# Altium project COMMS_ECU_revA.PrjPcb (part 2 of 3)

## Sheet SJA1105Q_PINOUT.SchDoc
size D; SheetNumber: 4; SheetTotal: 12
Used 2 times, as channels SJA1150Q_PINOUT_0, SJA1150Q_PINOUT_1. Parts and nets are listed once, with the designators drawn on the sheet.
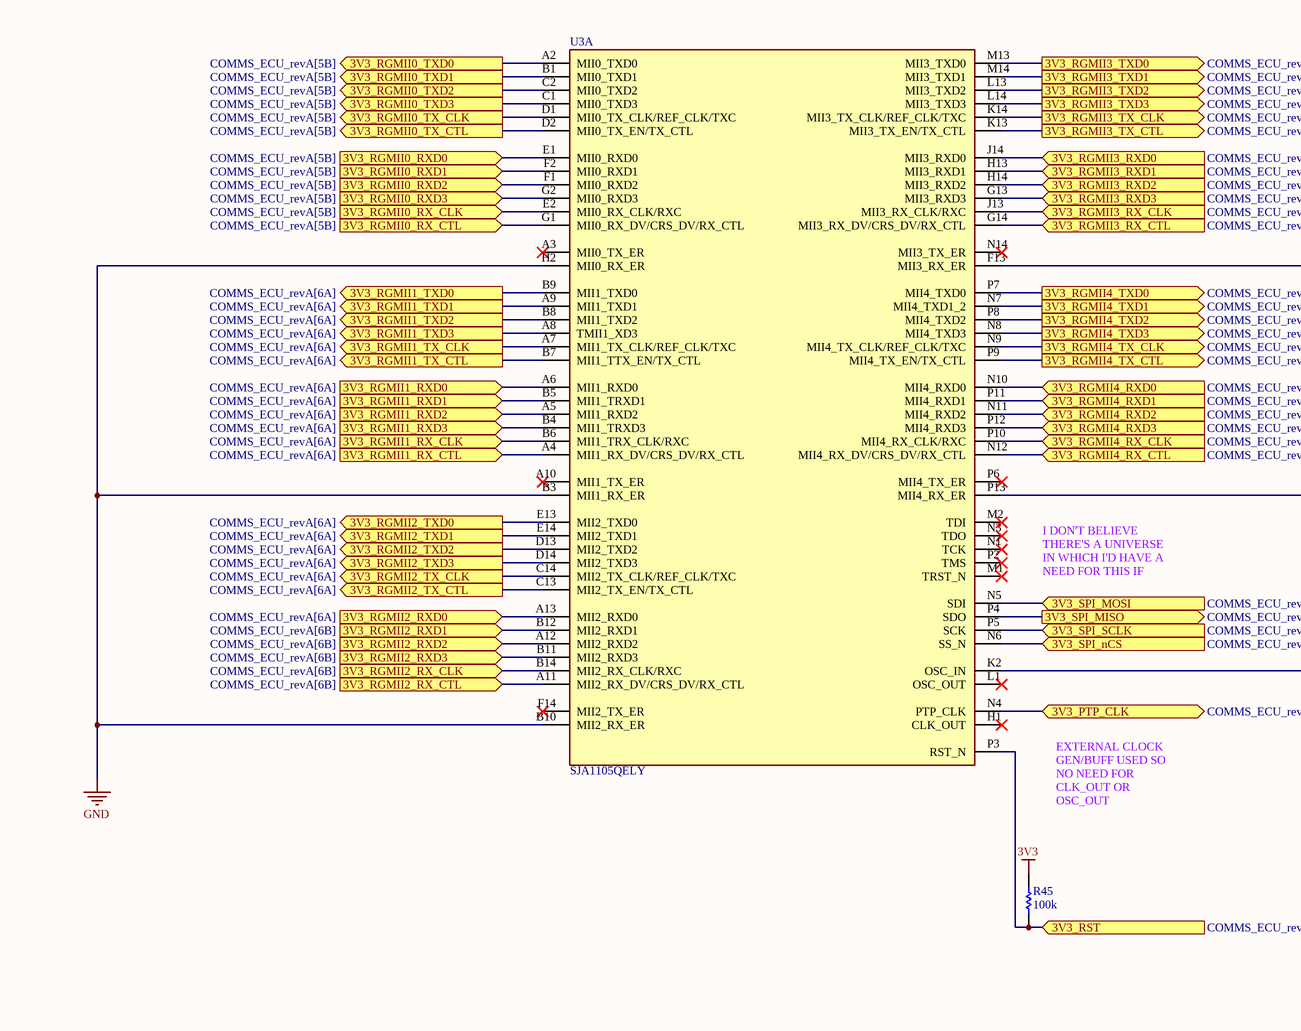
[diagram p5: SJA1105Q_PINOUT.SchDoc, top left]
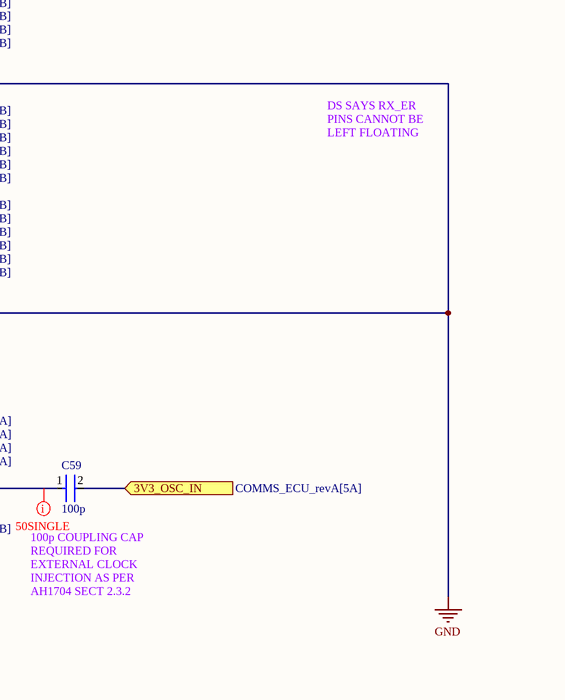
[diagram p6: SJA1105Q_PINOUT.SchDoc, top right]
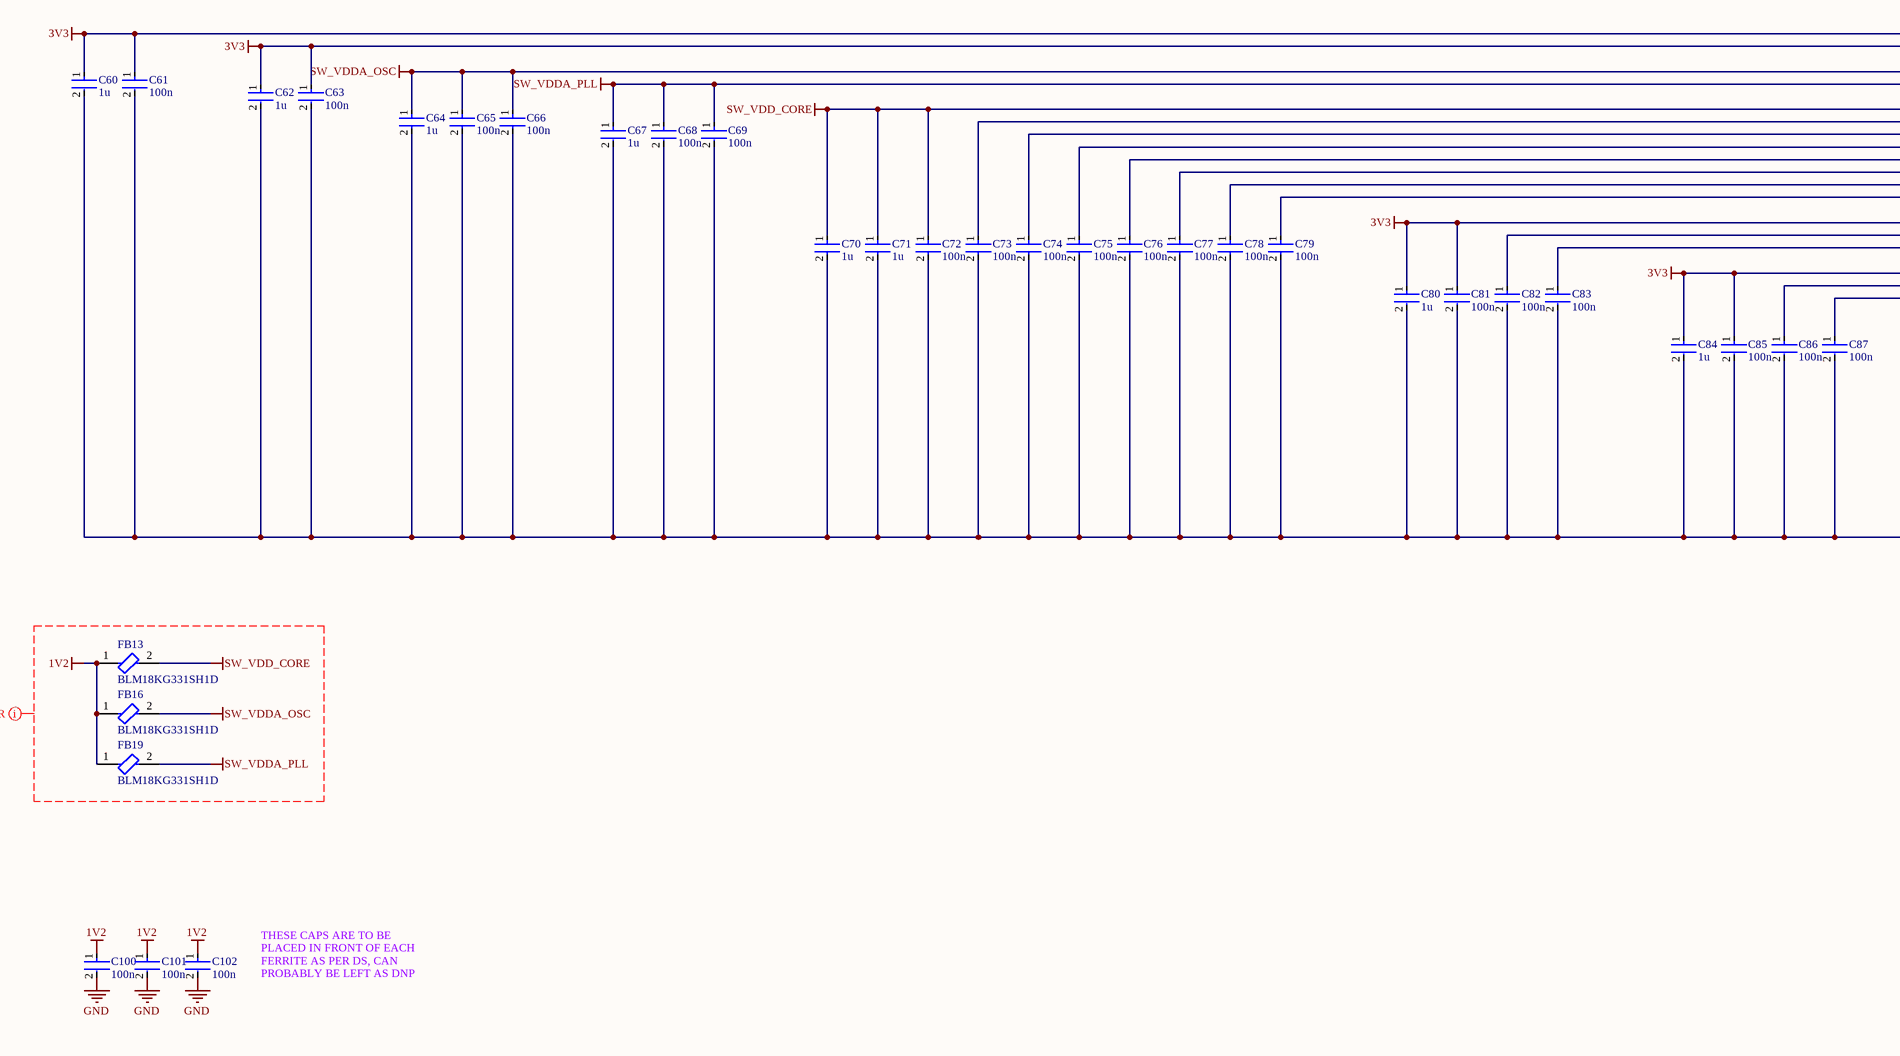
[diagram p7: SJA1105Q_PINOUT.SchDoc, bottom left]
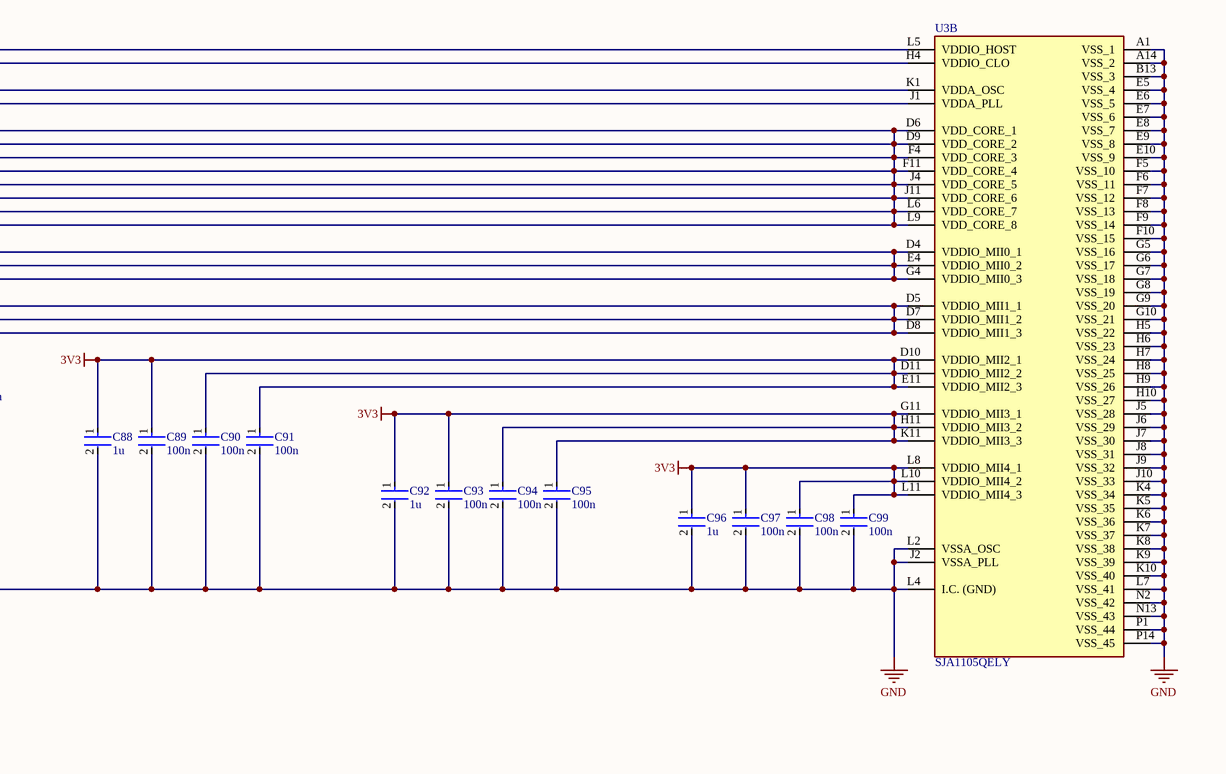
[diagram p8: SJA1105Q_PINOUT.SchDoc, bottom right]

### Parts
C59  100p  [FP-0402-L_1_0_0_05-W_0_5-IPC_A]
C60  1u  [FP-0402-L_1_0_0_05-W_0_5-IPC_A]
C61  100n  [FP-0402-L_1_0_0_05-W_0_5-IPC_A]
C62  1u  [FP-0402-L_1_0_0_05-W_0_5-IPC_A]
C63  100n  [FP-0402-L_1_0_0_05-W_0_5-IPC_A]
C64  1u  [FP-0402-L_1_0_0_05-W_0_5-IPC_A]
C65  100n  [FP-0402-L_1_0_0_05-W_0_5-IPC_A]
C66  100n  [FP-0402-L_1_0_0_05-W_0_5-IPC_A]
C67  1u  [FP-0402-L_1_0_0_05-W_0_5-IPC_A]
C68  100n  [FP-0402-L_1_0_0_05-W_0_5-IPC_A]
C69  100n  [FP-0402-L_1_0_0_05-W_0_5-IPC_A]
C70  1u  [FP-0402-L_1_0_0_05-W_0_5-IPC_A]
C71  1u  [FP-0402-L_1_0_0_05-W_0_5-IPC_A]
C72  100n  [FP-0402-L_1_0_0_05-W_0_5-IPC_A]
C73  100n  [FP-0402-L_1_0_0_05-W_0_5-IPC_A]
C74  100n  [FP-0402-L_1_0_0_05-W_0_5-IPC_A]
C75  100n  [FP-0402-L_1_0_0_05-W_0_5-IPC_A]
C76  100n  [FP-0402-L_1_0_0_05-W_0_5-IPC_A]
C77  100n  [FP-0402-L_1_0_0_05-W_0_5-IPC_A]
C78  100n  [FP-0402-L_1_0_0_05-W_0_5-IPC_A]
C79  100n  [FP-0402-L_1_0_0_05-W_0_5-IPC_A]
C80  1u  [FP-0402-L_1_0_0_05-W_0_5-IPC_A]
C81  100n  [FP-0402-L_1_0_0_05-W_0_5-IPC_A]
C82  100n  [FP-0402-L_1_0_0_05-W_0_5-IPC_A]
C83  100n  [FP-0402-L_1_0_0_05-W_0_5-IPC_A]
C84  1u  [FP-0402-L_1_0_0_05-W_0_5-IPC_A]
C85  100n  [FP-0402-L_1_0_0_05-W_0_5-IPC_A]
C86  100n  [FP-0402-L_1_0_0_05-W_0_5-IPC_A]
C87  100n  [FP-0402-L_1_0_0_05-W_0_5-IPC_A]
C88  1u  [FP-0402-L_1_0_0_05-W_0_5-IPC_A]
C89  100n  [FP-0402-L_1_0_0_05-W_0_5-IPC_A]
C90  100n  [FP-0402-L_1_0_0_05-W_0_5-IPC_A]
C91  100n  [FP-0402-L_1_0_0_05-W_0_5-IPC_A]
C92  1u  [FP-0402-L_1_0_0_05-W_0_5-IPC_A]
C93  100n  [FP-0402-L_1_0_0_05-W_0_5-IPC_A]
C94  100n  [FP-0402-L_1_0_0_05-W_0_5-IPC_A]
C95  100n  [FP-0402-L_1_0_0_05-W_0_5-IPC_A]
C96  1u  [FP-0402-L_1_0_0_05-W_0_5-IPC_A]
C97  100n  [FP-0402-L_1_0_0_05-W_0_5-IPC_A]
C98  100n  [FP-0402-L_1_0_0_05-W_0_5-IPC_A]
C99  100n  [FP-0402-L_1_0_0_05-W_0_5-IPC_A]
C100  100n  [FP-0402-L_1_0_0_05-W_0_5-IPC_A]
C101  100n  [FP-0402-L_1_0_0_05-W_0_5-IPC_A]
C102  100n  [FP-0402-L_1_0_0_05-W_0_5-IPC_A]
FB13  BLM18KG331SH1D  [FP-BLM18-0_15-t0_8-IPC_B]
FB16  BLM18KG331SH1D  [FP-BLM18-0_15-t0_8-IPC_B]
FB19  BLM18KG331SH1D  [FP-BLM18-0_15-t0_8-IPC_B]
R45  100k  [R0603B]
U3  SJA1105QELY  [SJA1105QELY-Footprint-1]  (parts A,B of 2)

### Ports
3V3_OSC_IN (in, see COMMS_ECU_revA[5A]), 3V3_PTP_CLK (bidir, see COMMS_ECU_revA[5B]), 3V3_RGMII0_RX_CLK (in, see COMMS_ECU_revA[5B]), 3V3_RGMII0_RX_CTL (in, see COMMS_ECU_revA[5B]), 3V3_RGMII0_RXD0 (in, see COMMS_ECU_revA[5B]), 3V3_RGMII0_RXD1 (in, see COMMS_ECU_revA[5B]), 3V3_RGMII0_RXD2 (in, see COMMS_ECU_revA[5B]), 3V3_RGMII0_RXD3 (in, see COMMS_ECU_revA[5B]), 3V3_RGMII0_TX_CLK (out, see COMMS_ECU_revA[5B]), 3V3_RGMII0_TX_CTL (out, see COMMS_ECU_revA[5B]), 3V3_RGMII0_TXD0 (out, see COMMS_ECU_revA[5B]), 3V3_RGMII0_TXD1 (out, see COMMS_ECU_revA[5B]), 3V3_RGMII0_TXD2 (out, see COMMS_ECU_revA[5B]), 3V3_RGMII0_TXD3 (out, see COMMS_ECU_revA[5B]), 3V3_RGMII1_RX_CLK (in, see COMMS_ECU_revA[6A]), 3V3_RGMII1_RX_CTL (in, see COMMS_ECU_revA[6A]), 3V3_RGMII1_RXD0 (in, see COMMS_ECU_revA[6A]), 3V3_RGMII1_RXD1 (in, see COMMS_ECU_revA[6A]), 3V3_RGMII1_RXD2 (in, see COMMS_ECU_revA[6A]), 3V3_RGMII1_RXD3 (in, see COMMS_ECU_revA[6A]), 3V3_RGMII1_TX_CLK (out, see COMMS_ECU_revA[6A]), 3V3_RGMII1_TX_CTL (out, see COMMS_ECU_revA[6A]), 3V3_RGMII1_TXD0 (out, see COMMS_ECU_revA[6A]), 3V3_RGMII1_TXD1 (out, see COMMS_ECU_revA[6A]), 3V3_RGMII1_TXD2 (out, see COMMS_ECU_revA[6A]), 3V3_RGMII1_TXD3 (out, see COMMS_ECU_revA[6A]), 3V3_RGMII2_RX_CLK (in, see COMMS_ECU_revA[6B]), 3V3_RGMII2_RX_CTL (in, see COMMS_ECU_revA[6B]), 3V3_RGMII2_RXD0 (in, see COMMS_ECU_revA[6A]), 3V3_RGMII2_RXD1 (in, see COMMS_ECU_revA[6B]), 3V3_RGMII2_RXD2 (in, see COMMS_ECU_revA[6B]), 3V3_RGMII2_RXD3 (in, see COMMS_ECU_revA[6B]), 3V3_RGMII2_TX_CLK (out, see COMMS_ECU_revA[6A]), 3V3_RGMII2_TX_CTL (out, see COMMS_ECU_revA[6A]), 3V3_RGMII2_TXD0 (out, see COMMS_ECU_revA[6A]), 3V3_RGMII2_TXD1 (out, see COMMS_ECU_revA[6A]), 3V3_RGMII2_TXD2 (out, see COMMS_ECU_revA[6A]), 3V3_RGMII2_TXD3 (out, see COMMS_ECU_revA[6A]), 3V3_RGMII3_RX_CLK (in, see COMMS_ECU_revA[6B]), 3V3_RGMII3_RX_CTL (in, see COMMS_ECU_revA[6B]), 3V3_RGMII3_RXD0 (in, see COMMS_ECU_revA[6B]), 3V3_RGMII3_RXD1 (in, see COMMS_ECU_revA[6B]), 3V3_RGMII3_RXD2 (in, see COMMS_ECU_revA[6B]), 3V3_RGMII3_RXD3 (in, see COMMS_ECU_revA[6B]), 3V3_RGMII3_TX_CLK (out, see COMMS_ECU_revA[6B]), 3V3_RGMII3_TX_CTL (out, see COMMS_ECU_revA[6B]), 3V3_RGMII3_TXD0 (out, see COMMS_ECU_revA[6B]), 3V3_RGMII3_TXD1 (out, see COMMS_ECU_revA[6B]), 3V3_RGMII3_TXD2 (out, see COMMS_ECU_revA[6B]), 3V3_RGMII3_TXD3 (out, see COMMS_ECU_revA[6B]), 3V3_RGMII4_RX_CLK (in, see COMMS_ECU_revA[6B]), 3V3_RGMII4_RX_CTL (in, see COMMS_ECU_revA[6B]), 3V3_RGMII4_RXD0 (in, see COMMS_ECU_revA[6B]), 3V3_RGMII4_RXD1 (in, see COMMS_ECU_revA[6B]), 3V3_RGMII4_RXD2 (in, see COMMS_ECU_revA[6B]), 3V3_RGMII4_RXD3 (in, see COMMS_ECU_revA[6B]), 3V3_RGMII4_TX_CLK (out, see COMMS_ECU_revA[6B]), 3V3_RGMII4_TX_CTL (out, see COMMS_ECU_revA[6B]), 3V3_RGMII4_TXD0 (out, see COMMS_ECU_revA[6B]), 3V3_RGMII4_TXD1 (out, see COMMS_ECU_revA[6B]), 3V3_RGMII4_TXD2 (out, see COMMS_ECU_revA[6B]), 3V3_RGMII4_TXD3 (out, see COMMS_ECU_revA[6B]), 3V3_RST (in, see COMMS_ECU_revA[5A]), 3V3_SPI_MISO (out, see COMMS_ECU_revA[5A]), 3V3_SPI_MOSI (in, see COMMS_ECU_revA[5A]), 3V3_SPI_nCS (in, see COMMS_ECU_revA[5A]), 3V3_SPI_SCLK (in, see COMMS_ECU_revA[5A])

### Nets
1V2: C100.1 C101.1 C102.1 FB13.1 FB16.1 FB19.1
3V3: C60.1 C61.1 C62.1 C63.1 C80.1 C81.1 C82.1 C83.1 C84.1 C85.1 C86.1 C87.1 C88.1 C89.1 C90.1 C91.1 C92.1 C93.1 C94.1 C95.1 C96.1 C97.1 C98.1 C99.1 R45.2 U3.D4(VDDIO_MII0_1) U3.D5(VDDIO_MII1_1) U3.D7(VDDIO_MII1_2) U3.D8(VDDIO_MII1_3) U3.D10(VDDIO_MII2_1) U3.D11(VDDIO_MII2_2) U3.E4(VDDIO_MII0_2) U3.E11(VDDIO_MII2_3) U3.G4(VDDIO_MII0_3) U3.G11(VDDIO_MII3_1) U3.H4(VDDIO_CLO) U3.H11(VDDIO_MII3_2) U3.K11(VDDIO_MII3_3) U3.L5(VDDIO_HOST) U3.L8(VDDIO_MII4_1) U3.L10(VDDIO_MII4_2) U3.L11(VDDIO_MII4_3)
GND: C60.2 C61.2 C62.2 C63.2 C64.2 C65.2 C66.2 C67.2 C68.2 C69.2 C70.2 C71.2 C72.2 C73.2 C74.2 C75.2 C76.2 C77.2 C78.2 C79.2 C80.2 C81.2 C82.2 C83.2 C84.2 C85.2 C86.2 C87.2 C88.2 C89.2 C90.2 C91.2 C92.2 C93.2 C94.2 C95.2 C96.2 C97.2 C98.2 C99.2 C100.2 C101.2 C102.2 U3.A1(VSS_1) U3.A14(VSS_2) U3.B3(MII1_RX_ER) U3.B10(MII2_RX_ER) U3.B13(VSS_3) U3.E5(VSS_4) U3.E6(VSS_5) U3.E7(VSS_6) U3.E8(VSS_7) U3.E9(VSS_8) U3.E10(VSS_9) U3.F5(VSS_10) U3.F6(VSS_11) U3.F7(VSS_12) U3.F8(VSS_13) U3.F9(VSS_14) U3.F10(VSS_15) U3.F13(MII3_RX_ER) U3.G5(VSS_16) U3.G6(VSS_17) U3.G7(VSS_18) U3.G8(VSS_19) U3.G9(VSS_20) U3.G10(VSS_21) U3.H2(MII0_RX_ER) U3.H5(VSS_22) U3.H6(VSS_23) U3.H7(VSS_24) U3.H8(VSS_25) U3.H9(VSS_26) U3.H10(VSS_27) U3.J2(VSSA_PLL) U3.J5(VSS_28) U3.J6(VSS_29) U3.J7(VSS_30) U3.J8(VSS_31) U3.J9(VSS_32) U3.J10(VSS_33) U3.K4(VSS_34) U3.K5(VSS_35) U3.K6(VSS_36) U3.K7(VSS_37) U3.K8(VSS_38) U3.K9(VSS_39) U3.K10(VSS_40) U3.L2(VSSA_OSC) U3.L4(I.C._(GND)) U3.L7(VSS_41) U3.N2(VSS_42) U3.N13(VSS_43) U3.P1(VSS_44) U3.P13(MII4_RX_ER) U3.P14(VSS_45)
SW_VDD_CORE: C70.1 C71.1 C72.1 C73.1 C74.1 C75.1 C76.1 C77.1 C78.1 C79.1 FB13.2 U3.D6(VDD_CORE_1) U3.D9(VDD_CORE_2) U3.F4(VDD_CORE_3) U3.F11(VDD_CORE_4) U3.J4(VDD_CORE_5) U3.J11(VDD_CORE_6) U3.L6(VDD_CORE_7) U3.L9(VDD_CORE_8)
SW_VDDA_OSC: C64.1 C65.1 C66.1 FB16.2 U3.K1(VDDA_OSC)
SW_VDDA_PLL: C67.1 C68.1 C69.1 FB19.2 U3.J1(VDDA_PLL)
3V3_OSC_IN: C59.2 ; port 3V3_OSC_IN
3V3_PTP_CLK: U3.N4(PTP_CLK) ; port 3V3_PTP_CLK
3V3_RGMII0_RX_CLK: U3.E2(MII0_RX_CLK/RXC) ; port 3V3_RGMII0_RX_CLK
3V3_RGMII0_RX_CTL: U3.G1(MII0_RX_DV/CRS_DV/RX_CTL) ; port 3V3_RGMII0_RX_CTL
3V3_RGMII0_RXD0: U3.E1(MII0_RXD0) ; port 3V3_RGMII0_RXD0
3V3_RGMII0_RXD1: U3.F2(MII0_RXD1) ; port 3V3_RGMII0_RXD1
3V3_RGMII0_RXD2: U3.F1(MII0_RXD2) ; port 3V3_RGMII0_RXD2
3V3_RGMII0_RXD3: U3.G2(MII0_RXD3) ; port 3V3_RGMII0_RXD3
3V3_RGMII0_TX_CLK: U3.D1(MII0_TX_CLK/REF_CLK/TXC) ; port 3V3_RGMII0_TX_CLK
3V3_RGMII0_TX_CTL: U3.D2(MII0_TX_EN/TX_CTL) ; port 3V3_RGMII0_TX_CTL
3V3_RGMII0_TXD0: U3.A2(MII0_TXD0) ; port 3V3_RGMII0_TXD0
3V3_RGMII0_TXD1: U3.B1(MII0_TXD1) ; port 3V3_RGMII0_TXD1
3V3_RGMII0_TXD2: U3.C2(MII0_TXD2) ; port 3V3_RGMII0_TXD2
3V3_RGMII0_TXD3: U3.C1(MII0_TXD3) ; port 3V3_RGMII0_TXD3
3V3_RGMII1_RX_CLK: U3.B6(MII1_TRX_CLK/RXC) ; port 3V3_RGMII1_RX_CLK
3V3_RGMII1_RX_CTL: U3.A4(MII1_RX_DV/CRS_DV/RX_CTL) ; port 3V3_RGMII1_RX_CTL
3V3_RGMII1_RXD0: U3.A6(MII1_RXD0) ; port 3V3_RGMII1_RXD0
3V3_RGMII1_RXD1: U3.B5(MII1_TRXD1) ; port 3V3_RGMII1_RXD1
3V3_RGMII1_RXD2: U3.A5(MII1_RXD2) ; port 3V3_RGMII1_RXD2
3V3_RGMII1_RXD3: U3.B4(MII1_TRXD3) ; port 3V3_RGMII1_RXD3
3V3_RGMII1_TX_CLK: U3.A7(MII1_TX_CLK/REF_CLK/TXC) ; port 3V3_RGMII1_TX_CLK
3V3_RGMII1_TX_CTL: U3.B7(MII1_TTX_EN/TX_CTL) ; port 3V3_RGMII1_TX_CTL
3V3_RGMII1_TXD0: U3.B9(MII1_TXD0) ; port 3V3_RGMII1_TXD0
3V3_RGMII1_TXD1: U3.A9(MII1_TXD1) ; port 3V3_RGMII1_TXD1
3V3_RGMII1_TXD2: U3.B8(MII1_TXD2) ; port 3V3_RGMII1_TXD2
3V3_RGMII1_TXD3: U3.A8(TMII1_XD3) ; port 3V3_RGMII1_TXD3
3V3_RGMII2_RX_CLK: U3.B14(MII2_RX_CLK/RXC) ; port 3V3_RGMII2_RX_CLK
3V3_RGMII2_RX_CTL: U3.A11(MII2_RX_DV/CRS_DV/RX_CTL) ; port 3V3_RGMII2_RX_CTL
3V3_RGMII2_RXD0: U3.A13(MII2_RXD0) ; port 3V3_RGMII2_RXD0
3V3_RGMII2_RXD1: U3.B12(MII2_RXD1) ; port 3V3_RGMII2_RXD1
3V3_RGMII2_RXD2: U3.A12(MII2_RXD2) ; port 3V3_RGMII2_RXD2
3V3_RGMII2_RXD3: U3.B11(MII2_RXD3) ; port 3V3_RGMII2_RXD3
3V3_RGMII2_TX_CLK: U3.C14(MII2_TX_CLK/REF_CLK/TXC) ; port 3V3_RGMII2_TX_CLK
3V3_RGMII2_TX_CTL: U3.C13(MII2_TX_EN/TX_CTL) ; port 3V3_RGMII2_TX_CTL
3V3_RGMII2_TXD0: U3.E13(MII2_TXD0) ; port 3V3_RGMII2_TXD0
3V3_RGMII2_TXD1: U3.E14(MII2_TXD1) ; port 3V3_RGMII2_TXD1
3V3_RGMII2_TXD2: U3.D13(MII2_TXD2) ; port 3V3_RGMII2_TXD2
3V3_RGMII2_TXD3: U3.D14(MII2_TXD3) ; port 3V3_RGMII2_TXD3
3V3_RGMII3_RX_CLK: U3.J13(MII3_RX_CLK/RXC) ; port 3V3_RGMII3_RX_CLK
3V3_RGMII3_RX_CTL: U3.G14(MII3_RX_DV/CRS_DV/RX_CTL) ; port 3V3_RGMII3_RX_CTL
3V3_RGMII3_RXD0: U3.J14(MII3_RXD0) ; port 3V3_RGMII3_RXD0
3V3_RGMII3_RXD1: U3.H13(MII3_RXD1) ; port 3V3_RGMII3_RXD1
3V3_RGMII3_RXD2: U3.H14(MII3_RXD2) ; port 3V3_RGMII3_RXD2
3V3_RGMII3_RXD3: U3.G13(MII3_RXD3) ; port 3V3_RGMII3_RXD3
3V3_RGMII3_TX_CLK: U3.K14(MII3_TX_CLK/REF_CLK/TXC) ; port 3V3_RGMII3_TX_CLK
3V3_RGMII3_TX_CTL: U3.K13(MII3_TX_EN/TX_CTL) ; port 3V3_RGMII3_TX_CTL
3V3_RGMII3_TXD0: U3.M13(MII3_TXD0) ; port 3V3_RGMII3_TXD0
3V3_RGMII3_TXD1: U3.M14(MII3_TXD1) ; port 3V3_RGMII3_TXD1
3V3_RGMII3_TXD2: U3.L13(MII3_TXD2) ; port 3V3_RGMII3_TXD2
3V3_RGMII3_TXD3: U3.L14(MII3_TXD3) ; port 3V3_RGMII3_TXD3
3V3_RGMII4_RX_CLK: U3.P10(MII4_RX_CLK/RXC) ; port 3V3_RGMII4_RX_CLK
3V3_RGMII4_RX_CTL: U3.N12(MII4_RX_DV/CRS_DV/RX_CTL) ; port 3V3_RGMII4_RX_CTL
3V3_RGMII4_RXD0: U3.N10(MII4_RXD0) ; port 3V3_RGMII4_RXD0
3V3_RGMII4_RXD1: U3.P11(MII4_RXD1) ; port 3V3_RGMII4_RXD1
3V3_RGMII4_RXD2: U3.N11(MII4_RXD2) ; port 3V3_RGMII4_RXD2
3V3_RGMII4_RXD3: U3.P12(MII4_RXD3) ; port 3V3_RGMII4_RXD3
3V3_RGMII4_TX_CLK: U3.N9(MII4_TX_CLK/REF_CLK/TXC) ; port 3V3_RGMII4_TX_CLK
3V3_RGMII4_TX_CTL: U3.P9(MII4_TX_EN/TX_CTL) ; port 3V3_RGMII4_TX_CTL
3V3_RGMII4_TXD0: U3.P7(MII4_TXD0) ; port 3V3_RGMII4_TXD0
3V3_RGMII4_TXD1: U3.N7(MII4_TXD1_2) ; port 3V3_RGMII4_TXD1
3V3_RGMII4_TXD2: U3.P8(MII4_TXD2) ; port 3V3_RGMII4_TXD2
3V3_RGMII4_TXD3: U3.N8(MII4_TXD3) ; port 3V3_RGMII4_TXD3
3V3_RST: R45.1 U3.P3(RST_N) ; port 3V3_RST
3V3_SPI_MISO: U3.P4(SDO) ; port 3V3_SPI_MISO
3V3_SPI_MOSI: U3.N5(SDI) ; port 3V3_SPI_MOSI
3V3_SPI_nCS: U3.N6(SS_N) ; port 3V3_SPI_nCS
3V3_SPI_SCLK: U3.P5(SCK) ; port 3V3_SPI_SCLK
NetC59_1: C59.1 U3.K2(OSC_IN)

Not connected (* = marked no-connect by the designer): U3 A3(MII0_TX_ER)* A10(MII1_TX_ER)* F14(MII2_TX_ER)* H1(CLK_OUT)* L1(OSC_OUT)* M1(TRST_N)* M2(TDI)* N1(TCK)* N3(TDO)* N14(MII3_TX_ER)* P2(TMS)* P6(MII4_TX_ER)*

### Channels
SJA1150Q_PINOUT_0: designators end in _SJA1150Q_PINOUT_0; ports 3V3_OSC_IN=3V3_SJA1105_0_CLK 3V3_PTP_CLK=NetU3_SJA1150Q_PINOUT_0_N4 3V3_RGMII0_RX_CLK=NetU3_SJA1150Q_PINOUT_0_E2 3V3_RGMII0_RX_CTL=NetU3_SJA1150Q_PINOUT_0_G1 3V3_RGMII0_RXD0=NetU3_SJA1150Q_PINOUT_0_E1 3V3_RGMII0_RXD1=NetU3_SJA1150Q_PINOUT_0_F2 3V3_RGMII0_RXD2=NetU3_SJA1150Q_PINOUT_0_F1 3V3_RGMII0_RXD3=NetU3_SJA1150Q_PINOUT_0_G2 3V3_RGMII0_TX_CLK=NetU3_SJA1150Q_PINOUT_0_D1 3V3_RGMII0_TX_CTL=NetU3_SJA1150Q_PINOUT_0_D2 3V3_RGMII0_TXD0=NetU3_SJA1150Q_PINOUT_0_A2 3V3_RGMII0_TXD1=NetU3_SJA1150Q_PINOUT_0_B1 3V3_RGMII0_TXD2=NetU3_SJA1150Q_PINOUT_0_C2 3V3_RGMII0_TXD3=NetU3_SJA1150Q_PINOUT_0_C1 3V3_RGMII1_RX_CLK=LAN8870_RX_CLK 3V3_RGMII1_RX_CTL=LAN8870_RXCTL 3V3_RGMII1_RXD0=LAN8870_RXD0 3V3_RGMII1_RXD1=LAN8870_RXD1 3V3_RGMII1_RXD2=LAN8870_RXD2 3V3_RGMII1_RXD3=LAN8870_RXD3 3V3_RGMII1_TX_CLK=LAN8870_TX_CLK 3V3_RGMII1_TX_CTL=LAN8870_TX_CTL 3V3_RGMII1_TXD0=LAN8870_TXD0 3V3_RGMII1_TXD1=LAN8870_TXD1 3V3_RGMII1_TXD2=LAN8870_TXD2 3V3_RGMII1_TXD3=LAN8870_TXD3 3V3_RGMII2_RX_CLK=LAN8870_RX_CLK 3V3_RGMII2_RX_CTL=LAN8870_RXCTL 3V3_RGMII2_RXD0=LAN8870_RXD0 3V3_RGMII2_RXD1=LAN8870_RXD1 3V3_RGMII2_RXD2=LAN8870_RXD2 3V3_RGMII2_RXD3=LAN8870_RXD3 3V3_RGMII2_TX_CLK=LAN8870_TX_CLK 3V3_RGMII2_TX_CTL=LAN8870_TX_CTL 3V3_RGMII2_TXD0=LAN8870_TXD0 3V3_RGMII2_TXD1=LAN8870_TXD1 3V3_RGMII2_TXD2=LAN8870_TXD2 3V3_RGMII2_TXD3=LAN8870_TXD3 3V3_RGMII3_RX_CLK=LAN8870_RX_CLK 3V3_RGMII3_RX_CTL=LAN8870_RXCTL 3V3_RGMII3_RXD0=LAN8870_RXD0 3V3_RGMII3_RXD1=LAN8870_RXD1 3V3_RGMII3_RXD2=LAN8870_RXD2 3V3_RGMII3_RXD3=LAN8870_RXD3 3V3_RGMII3_TX_CLK=LAN8870_TX_CLK 3V3_RGMII3_TX_CTL=LAN8870_TX_CTL 3V3_RGMII3_TXD0=LAN8870_TXD0 3V3_RGMII3_TXD1=LAN8870_TXD1 3V3_RGMII3_TXD2=LAN8870_TXD2 3V3_RGMII3_TXD3=LAN8870_TXD3 3V3_RGMII4_RX_CLK=LAN8870_RX_CLK 3V3_RGMII4_RX_CTL=LAN8870_RXCTL 3V3_RGMII4_RXD0=LAN8870_RXD0 3V3_RGMII4_RXD1=LAN8870_RXD1 3V3_RGMII4_RXD2=LAN8870_RXD2 3V3_RGMII4_RXD3=LAN8870_RXD3 3V3_RGMII4_TX_CLK=LAN8870_TX_CLK 3V3_RGMII4_TX_CTL=LAN8870_TX_CTL 3V3_RGMII4_TXD0=LAN8870_TXD0 3V3_RGMII4_TXD1=LAN8870_TXD1 3V3_RGMII4_TXD2=LAN8870_TXD2 3V3_RGMII4_TXD3=LAN8870_TXD3 3V3_RST=3V3_SJA1150Q_0_nRST 3V3_SPI_MISO=3V3_SJA1150Q_MISO 3V3_SPI_MOSI=3V3_SJA1150Q_MOSI 3V3_SPI_nCS=3V3_SJA1150Q_0_nCS 3V3_SPI_SCLK=3V3_SJA1150Q_SCLK
SJA1150Q_PINOUT_1: designators end in _SJA1150Q_PINOUT_1; ports 3V3_OSC_IN=3V3_SJA1105_1_CLK 3V3_PTP_CLK=NetU3_SJA1150Q_PINOUT_0_N4 3V3_RGMII0_RX_CLK=NetU3_SJA1150Q_PINOUT_0_D1 3V3_RGMII0_RX_CTL=NetU3_SJA1150Q_PINOUT_0_D2 3V3_RGMII0_RXD0=NetU3_SJA1150Q_PINOUT_0_A2 3V3_RGMII0_RXD1=NetU3_SJA1150Q_PINOUT_0_B1 3V3_RGMII0_RXD2=NetU3_SJA1150Q_PINOUT_0_C2 3V3_RGMII0_RXD3=NetU3_SJA1150Q_PINOUT_0_C1 3V3_RGMII0_TX_CLK=NetU3_SJA1150Q_PINOUT_0_E2 3V3_RGMII0_TX_CTL=NetU3_SJA1150Q_PINOUT_0_G1 3V3_RGMII0_TXD0=NetU3_SJA1150Q_PINOUT_0_E1 3V3_RGMII0_TXD1=NetU3_SJA1150Q_PINOUT_0_F2 3V3_RGMII0_TXD2=NetU3_SJA1150Q_PINOUT_0_F1 3V3_RGMII0_TXD3=NetU3_SJA1150Q_PINOUT_0_G2 3V3_RGMII1_RX_CLK=LAN8870_RX_CLK 3V3_RGMII1_RX_CTL=LAN8870_RXCTL 3V3_RGMII1_RXD0=LAN8870_RXD0 3V3_RGMII1_RXD1=LAN8870_RXD1 3V3_RGMII1_RXD2=LAN8870_RXD2 3V3_RGMII1_RXD3=LAN8870_RXD3 3V3_RGMII1_TX_CLK=LAN8870_TX_CLK 3V3_RGMII1_TX_CTL=LAN8870_TX_CTL 3V3_RGMII1_TXD0=LAN8870_TXD0 3V3_RGMII1_TXD1=LAN8870_TXD1 3V3_RGMII1_TXD2=LAN8870_TXD2 3V3_RGMII1_TXD3=LAN8870_TXD3 3V3_RGMII2_RX_CLK=LAN8870_RX_CLK 3V3_RGMII2_RX_CTL=LAN8870_RXCTL 3V3_RGMII2_RXD0=LAN8870_RXD0 3V3_RGMII2_RXD1=LAN8870_RXD1 3V3_RGMII2_RXD2=LAN8870_RXD2 3V3_RGMII2_RXD3=LAN8870_RXD3 3V3_RGMII2_TX_CLK=LAN8870_TX_CLK 3V3_RGMII2_TX_CTL=LAN8870_TX_CTL 3V3_RGMII2_TXD0=LAN8870_TXD0 3V3_RGMII2_TXD1=LAN8870_TXD1 3V3_RGMII2_TXD2=LAN8870_TXD2 3V3_RGMII2_TXD3=LAN8870_TXD3 3V3_RGMII3_RX_CLK=LAN8830_MODE4 3V3_RGMII3_RX_CTL=LAN8830_CLK125_EN 3V3_RGMII3_RXD0=LAN8830_MODE0 3V3_RGMII3_RXD1=LAN8830_MODE1 3V3_RGMII3_RXD2=LAN8830_MODE2 3V3_RGMII3_RXD3=LAN8830_MODE3 3V3_RGMII3_TX_CLK=NetU1_25 3V3_RGMII3_TX_CTL=NetU1_26 3V3_RGMII3_TXD0=NetU1_19 3V3_RGMII3_TXD1=NetU1_20 3V3_RGMII3_TXD2=NetU1_21 3V3_RGMII3_TXD3=NetU1_22 3V3_RGMII4_RX_CLK=NetU3_SJA1150Q_PINOUT_1_P10 3V3_RGMII4_RX_CTL=NetU3_SJA1150Q_PINOUT_1_N12 3V3_RGMII4_RXD0=NetU3_SJA1150Q_PINOUT_1_N10 3V3_RGMII4_RXD1=NetU3_SJA1150Q_PINOUT_1_P11 3V3_RGMII4_RXD2=NetU3_SJA1150Q_PINOUT_1_N11 3V3_RGMII4_RXD3=NetU3_SJA1150Q_PINOUT_1_P12 3V3_RGMII4_TX_CLK=NetU3_SJA1150Q_PINOUT_1_N9 3V3_RGMII4_TX_CTL=NetU3_SJA1150Q_PINOUT_1_P9 3V3_RGMII4_TXD0=NetU3_SJA1150Q_PINOUT_1_P7 3V3_RGMII4_TXD1=NetU3_SJA1150Q_PINOUT_1_N7 3V3_RGMII4_TXD2=NetU3_SJA1150Q_PINOUT_1_P8 3V3_RGMII4_TXD3=NetU3_SJA1150Q_PINOUT_1_N8 3V3_RST=3V3_SJA1150Q_1_nRST 3V3_SPI_MISO=3V3_SJA1150Q_MISO 3V3_SPI_MOSI=3V3_SJA1150Q_MOSI 3V3_SPI_nCS=3V3_SJA1150Q_1_nCS 3V3_SPI_SCLK=3V3_SJA1150Q_SCLK

### Layout directives
net class PWR: 1V2, SW_VDD_CORE, SW_VDDA_OSC, SW_VDDA_PLL
net class 50SINGLE: NetC59_SJA1150Q_PINOUT_0_1

### Notes on the sheet
- DS SAYS RX_ER PINS CANNOT BE LEFT FLOATING
- I DON'T BELIEVE THERE'S A UNIVERSE IN WHICH I'D HAVE A NEED FOR THIS IF
- EXTERNAL CLOCK GEN/BUFF USED SO NO NEED FOR CLK_OUT OR OSC_OUT
- (near C59) 100p COUPLING CAP REQUIRED FOR EXTERNAL CLOCK INJECTION AS PER AH1704 SECT 2.3.2
- THESE CAPS ARE TO BE PLACED IN FRONT OF EACH FERRITE AS PER DS, CAN PROBABLY BE LEFT AS DNP THO

### Library data of the parts
C59-C102 = CMP-001-00058-1: LARGE PADS, 0402 CAP, CHANGE COMMENT TO MATCH REAL P/N; Capacitor Type: Ceramic; Min Operating Temperature: -55°C; Mounting Technology: Surface Mount; Pins: 2; Case/Package: 0402; RoHS Compliant: Yes; Max Operating Temperature: 85°C
FB13 FB16 FB19 = CMP-06046-002069-1: Chip Ferrite Bead, 0603, 330Ω @ 100MHz, 0.08Ω, 25%, 1.7A; Number of Lines: 1; DC Resistance (DCR): 80mR; Packaging: Tape and Reel; Case/Package: 0603; Height: 0.037inch; Case Code (Metric): 1608; Length: 0.063inch; Package Quantity: 4000; Max Operating Temperature: 125°C; Case Code (Imperial): 0603; RoHS Compliant: Yes; Width: 0.032inch; Mount: Surface Mount; Min Operating Temperature: -55°C; Ratings: AEC-Q200; Max Current Rating: 1.7A
R45 = CMP-009-00002-14: Resistor; Value: 100k
U3 = CMP-015-00025-2: Ethernet Controller, Ethernet Switch, IEEE 802.3, 1.2 V, LFBGA, 159 Pins; Min Operating Temperature: -40°C; Max Operating Temperature: 105°C

## Sheet LAN8870_PINOUT.SchDoc
size C; SheetNumber: 3; SheetTotal: 12
Used 6 times, as channels PHY_0, PHY_5, PHY_1, PHY_2, PHY_3, PHY_4. Parts and nets are listed once, with the designators drawn on the sheet.
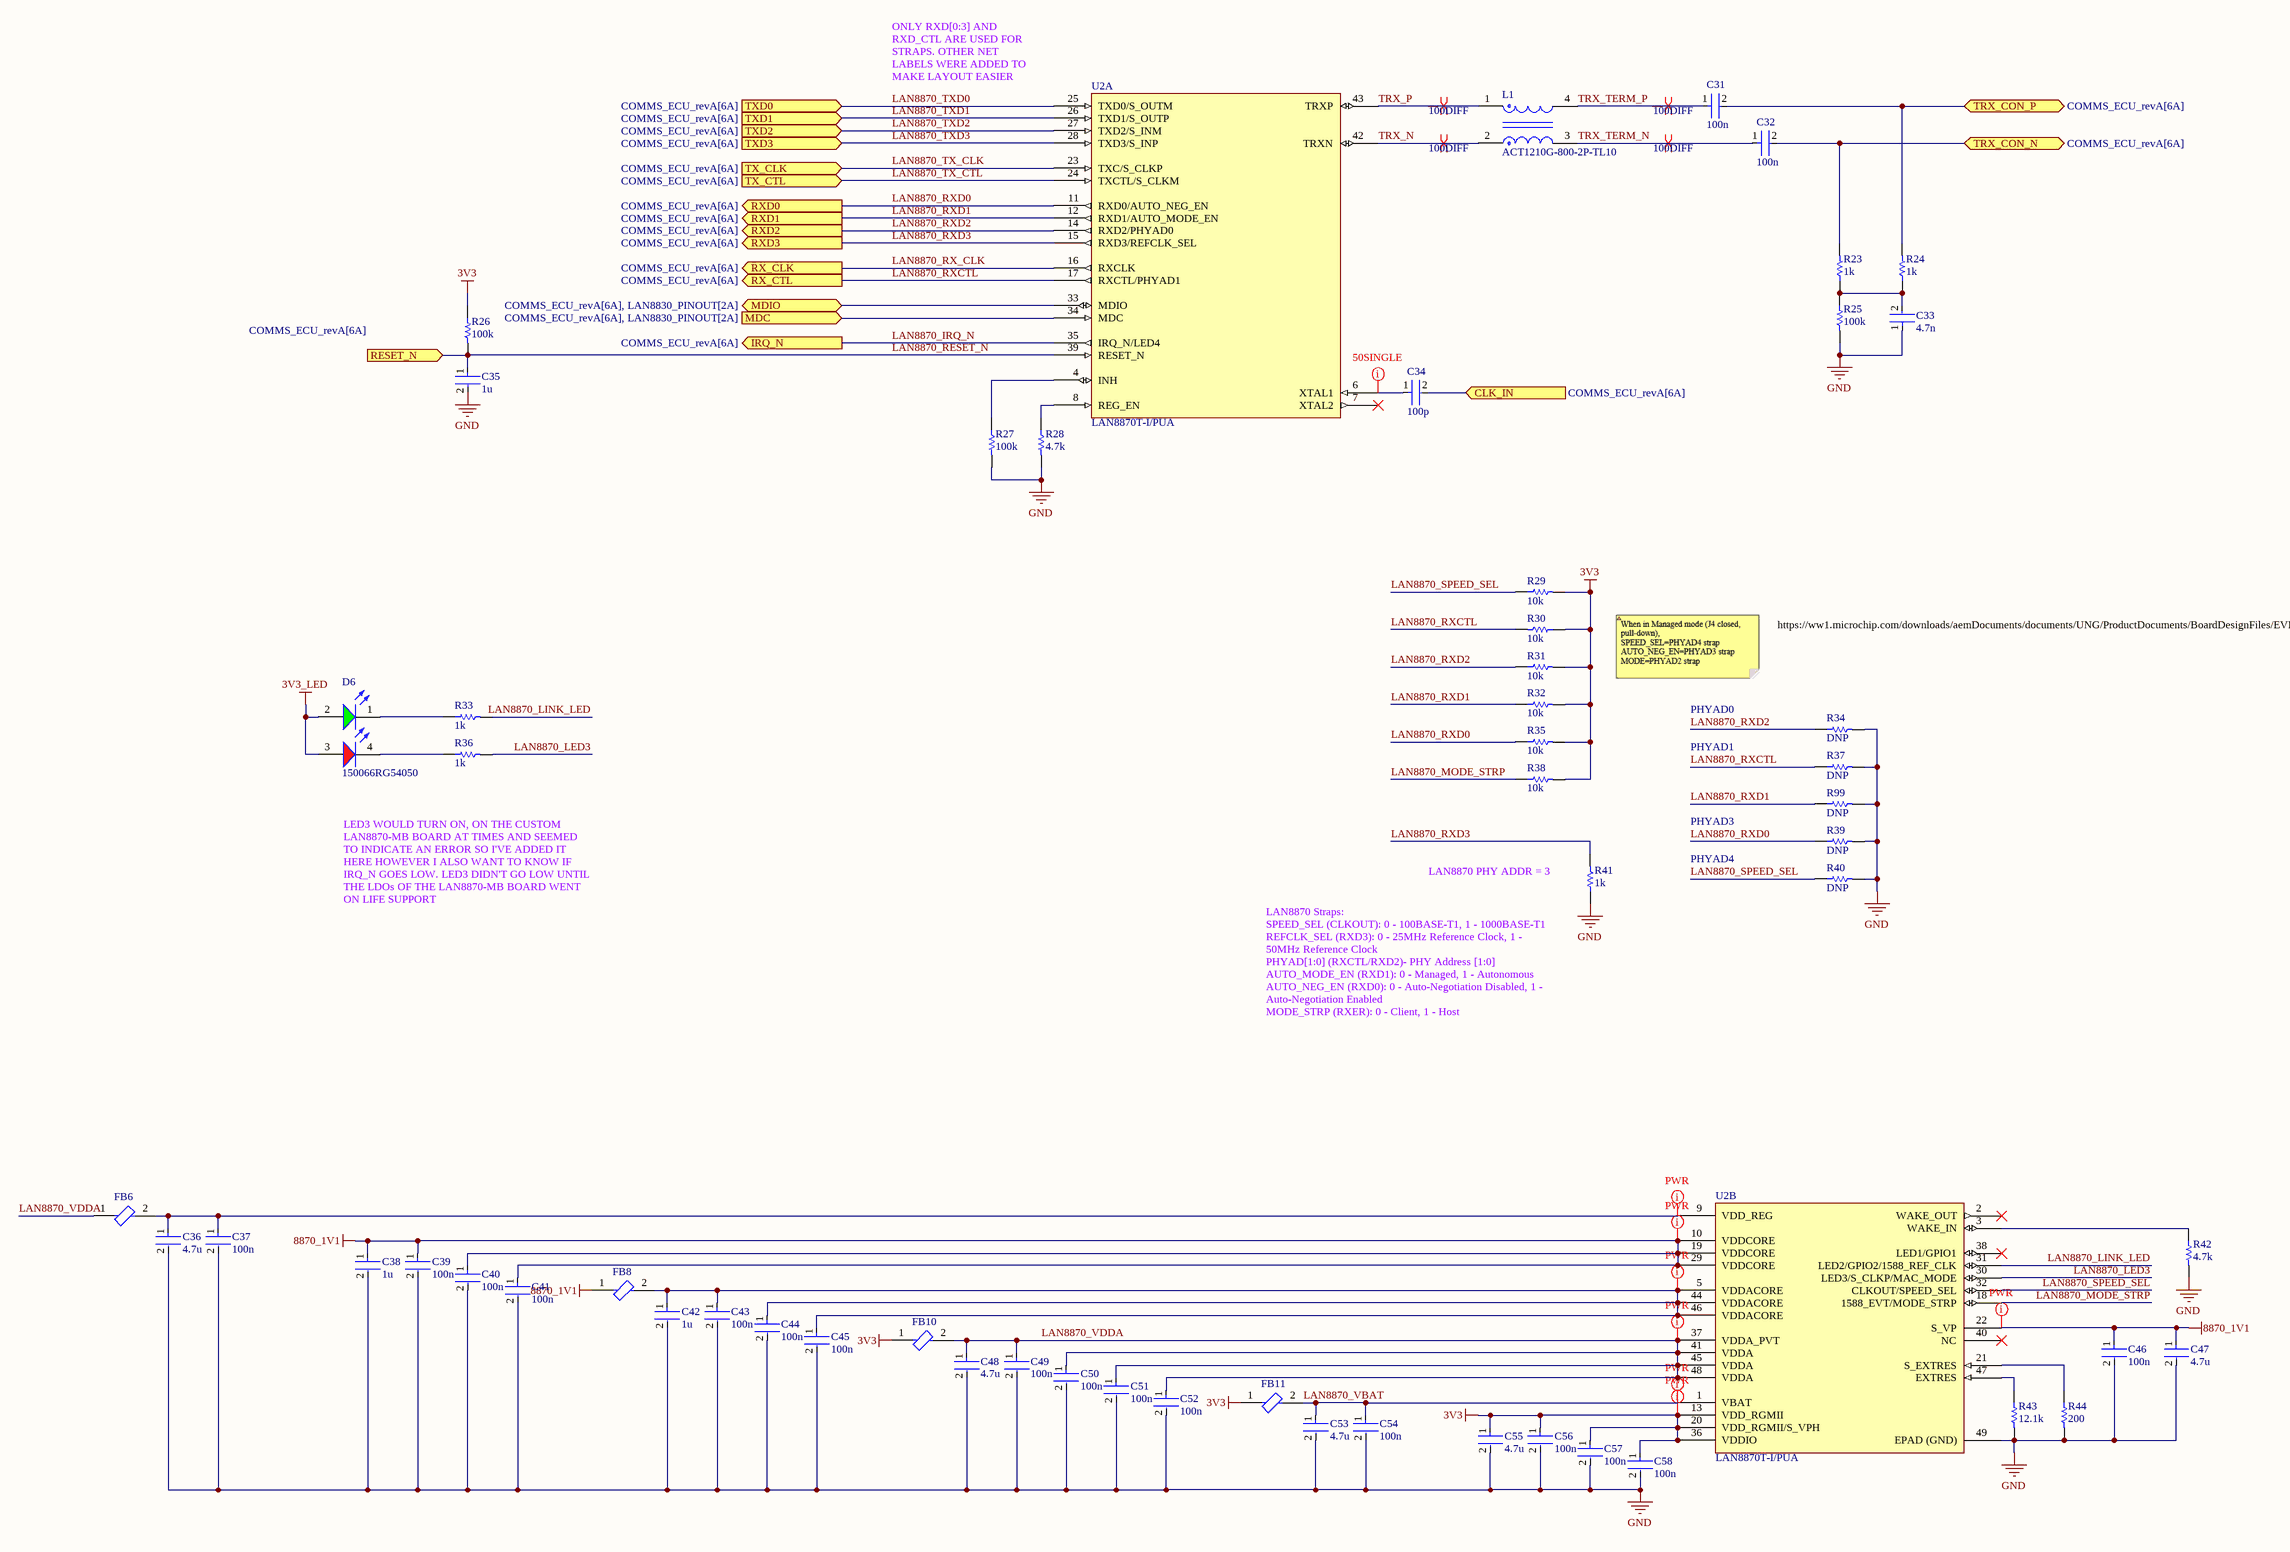
[diagram p9: LAN8870_PINOUT.SchDoc]

### Parts
C31  100n  [FP-0402-L_1_0_0_05-W_0_5-IPC_A]
C32  100n  [FP-0402-L_1_0_0_05-W_0_5-IPC_A]
C33  4.7n  [FP-0402-L_1_0_0_05-W_0_5-IPC_A]
C34  100p  [FP-0402-L_1_0_0_05-W_0_5-IPC_A]
C35  1u  [FP-0402-L_1_0_0_05-W_0_5-IPC_A]
C36  4.7u  [FP-0402-L_1_0_0_05-W_0_5-IPC_A]
C37  100n  [FP-0402-L_1_0_0_05-W_0_5-IPC_A]
C38  1u  [FP-0402-L_1_0_0_05-W_0_5-IPC_A]
C39  100n  [FP-0402-L_1_0_0_05-W_0_5-IPC_A]
C40  100n  [FP-0402-L_1_0_0_05-W_0_5-IPC_A]
C41  100n  [FP-0402-L_1_0_0_05-W_0_5-IPC_A]
C42  1u  [FP-0402-L_1_0_0_05-W_0_5-IPC_A]
C43  100n  [FP-0402-L_1_0_0_05-W_0_5-IPC_A]
C44  100n  [FP-0402-L_1_0_0_05-W_0_5-IPC_A]
C45  100n  [FP-0402-L_1_0_0_05-W_0_5-IPC_A]
C46  100n  [FP-0402-L_1_0_0_05-W_0_5-IPC_A]
C47  4.7u  [FP-0402-L_1_0_0_05-W_0_5-IPC_A]
C48  4.7u  [FP-0402-L_1_0_0_05-W_0_5-IPC_A]
C49  100n  [FP-0402-L_1_0_0_05-W_0_5-IPC_A]
C50  100n  [FP-0402-L_1_0_0_05-W_0_5-IPC_A]
C51  100n  [FP-0402-L_1_0_0_05-W_0_5-IPC_A]
C52  100n  [FP-0402-L_1_0_0_05-W_0_5-IPC_A]
C53  4.7u  [FP-0402-L_1_0_0_05-W_0_5-IPC_A]
C54  100n  [FP-0402-L_1_0_0_05-W_0_5-IPC_A]
C55  4.7u  [FP-0402-L_1_0_0_05-W_0_5-IPC_A]
C56  100n  [FP-0402-L_1_0_0_05-W_0_5-IPC_A]
C57  100n  [FP-0402-L_1_0_0_05-W_0_5-IPC_A]
C58  100n  [FP-0402-L_1_0_0_05-W_0_5-IPC_A]
D6  150066RG54050  [WL-SBCD_0606]
FB6  BLM18KG331SH1D  [FP-BLM18-0_15-t0_8-IPC_B]  (value not drawn)
FB8  BLM18KG331SH1D  [FP-BLM18-0_15-t0_8-IPC_B]  (value not drawn)
FB10  BLM18KG331SH1D  [FP-BLM18-0_15-t0_8-IPC_B]  (value not drawn)
FB11  BLM18KG331SH1D  [FP-BLM18-0_15-t0_8-IPC_B]  (value not drawn)
L1  ACT1210G-800-2P-TL10  [FP-ACT1210G-800-2P-TL10-MFG]
R23  1k  [R0603B]
R24  1k  [R0603B]
R25  100k  [R0603B]
R26  100k  [R0603B]
R27  100k  [R0603B]
R28  4.7k  [R0603B]
R29  10k  [R0603B]
R30  10k  [R0603B]
R31  10k  [R0603B]
R32  10k  [R0603B]
R33  1k  [R0603B]
R34  DNP  [R0603B]
R35  10k  [R0603B]
R36  1k  [R0603B]
R37  DNP  [R0603B]
R38  10k  [R0603B]
R39  DNP  [R0603B]
R40  DNP  [R0603B]
R41  1k  [R0603B]
R42  4.7k  [R0603B]
R43  12.1k  [R0603B]
R44  200  [R0603B]
R99  DNP  [R0603B]
U2  LAN8870T-I/PUA  [QFN50P700X700X100_HS-49N]  (parts A,B of 2)

### Ports
CLK_IN (in, see COMMS_ECU_revA[6A]), IRQ_N (out, see COMMS_ECU_revA[6A]), MDC (in, see COMMS_ECU_revA[6A], LAN8830_PINOUT[2A]), MDIO (bidir, see COMMS_ECU_revA[6A], LAN8830_PINOUT[2A]), RESET_N (in, see COMMS_ECU_revA[6A]), RX_CLK (out, see COMMS_ECU_revA[6A]), RX_CTL (out, see COMMS_ECU_revA[6A]), RXD0 (out, see COMMS_ECU_revA[6A]), RXD1 (out, see COMMS_ECU_revA[6A]), RXD2 (out, see COMMS_ECU_revA[6A]), RXD3 (out, see COMMS_ECU_revA[6A]), TRX_CON_N (bidir, see COMMS_ECU_revA[6A]), TRX_CON_P (bidir, see COMMS_ECU_revA[6A]), TX_CLK (in, see COMMS_ECU_revA[6A]), TX_CTL (in, see COMMS_ECU_revA[6A]), TXD0 (in, see COMMS_ECU_revA[6A]), TXD1 (in, see COMMS_ECU_revA[6A]), TXD2 (in, see COMMS_ECU_revA[6A]), TXD3 (in, see COMMS_ECU_revA[6A])

### Nets
3V3: C55.1 C56.1 C57.1 C58.1 FB10.1 FB11.1 R26.1 R29.2 R30.1 R31.2 R32.2 R35.2 R38.2 U2.13(VDD_RGMII) U2.20(VDD_RGMII/S_VPH) U2.36(VDDIO)
3V3_LED: D6.2(A) D6.3(A)
8870_1V1: C38.1 C39.1 C40.1 C41.1 C46.1 C47.1 FB8.1 U2.10(VDDCORE) U2.19(VDDCORE) U2.22(S_VP) U2.29(VDDCORE)
GND: C33.1 C35.2 C36.2 C37.2 C38.2 C39.2 C40.2 C41.2 C42.2 C43.2 C44.2 C45.2 C46.2 C47.2 C48.2 C49.2 C50.2 C51.2 C52.2 C53.2 C54.2 C55.2 C56.2 C57.2 C58.2 R25.2 R27.2 R28.2 R34.2 R37.2 R39.2 R40.2 R41.1 R42.2 R43.2 R44.2 R99.2 U2.49(EPAD_(GND))
CLK_IN: C34.2 ; port CLK_IN
LAN8870_IRQ_N: U2.35(IRQ_N/LED4) ; port IRQ_N
LAN8870_LED3: R36.2 U2.30(LED3/S_CLKP/MAC_MODE)
LAN8870_LINK_LED: R33.2 U2.31(LED2/GPIO2/1588_REF_CLK)
LAN8870_MODE_STRP: R38.1 U2.18(1588_EVT/MODE_STRP)
LAN8870_RESET_N: C35.1 R26.2 U2.39(RESET_N) ; port RESET_N
LAN8870_RX_CLK: U2.16(RXCLK) ; port RX_CLK
LAN8870_RXCTL: R30.2 R37.1 U2.17(RXCTL/PHYAD1) ; port RX_CTL
LAN8870_RXD0: R35.1 R39.1 U2.11(RXD0/AUTO_NEG_EN) ; port RXD0
LAN8870_RXD1: R32.1 R99.1 U2.12(RXD1/AUTO_MODE_EN) ; port RXD1
LAN8870_RXD2: R31.1 R34.1 U2.14(RXD2/PHYAD0) ; port RXD2
LAN8870_RXD3: R41.2 U2.15(RXD3/REFCLK_SEL) ; port RXD3
LAN8870_SPEED_SEL: R29.1 R40.1 U2.32(CLKOUT/SPEED_SEL)
LAN8870_TX_CLK: U2.23(TXC/S_CLKP) ; port TX_CLK
LAN8870_TX_CTL: U2.24(TXCTL/S_CLKM) ; port TX_CTL
LAN8870_TXD0: U2.25(TXD0/S_OUTM) ; port TXD0
LAN8870_TXD1: U2.26(TXD1/S_OUTP) ; port TXD1
LAN8870_TXD2: U2.27(TXD2/S_INM) ; port TXD2
LAN8870_TXD3: U2.28(TXD3/S_INP) ; port TXD3
LAN8870_VBAT: C53.1 C54.1 FB11.2 U2.1(VBAT)
LAN8870_VDDA: C48.1 C49.1 C50.1 C51.1 C52.1 FB6.1 FB10.2 U2.37(VDDA_PVT) U2.41(VDDA) U2.45(VDDA) U2.48(VDDA)
MDC: U2.34(MDC) ; port MDC
MDIO: U2.33(MDIO) ; port MDIO
TRX_CON_N: C32.2 R23.2 ; port TRX_CON_N
TRX_CON_P: C31.2 R24.2 ; port TRX_CON_P
TRX_N: L1.2 U2.42(TRXN)
TRX_P: L1.1 U2.43(TRXP)
TRX_TERM_N: C32.1 L1.3
TRX_TERM_P: C31.1 L1.4
NetC33_2: C33.2 R23.1 R24.1 R25.1
NetC34_1: C34.1 U2.6(XTAL1)
NetC36_1: C36.1 C37.1 FB6.2 U2.9(VDD_REG)
NetC42_1: C42.1 C43.1 C44.1 C45.1 FB8.2 U2.5(VDDACORE) U2.44(VDDACORE) U2.46(VDDACORE)
NetD6_1: D6.1(K) R33.1
NetD6_4: D6.4(K) R36.1
NetR27_1: R27.1 U2.4(INH)
NetR28_1: R28.1 U2.8(REG_EN)
NetR42_1: R42.1 U2.3(WAKE_IN)
NetR43_1: R43.1 U2.47(EXTRES)
NetR44_1: R44.1 U2.21(S_EXTRES)

Not connected (* = marked no-connect by the designer): U2 2(WAKE_OUT)* 7(XTAL2)* 38(LED1/GPIO1)* 40(NC)*

### Channels
PHY_0: designators end in _PHY_0; ports CLK_IN=3V3_LAN8870_0_CLK IRQ_N=3V3_LAN8870_0_nIRQ MDC=3V3_MDC MDIO=3V3_MDIO RESET_N=3V3_LAN8870_0_nRST RX_CLK=LAN8870_RX_CLK RX_CTL=LAN8870_RXCTL RXD0=LAN8870_RXD0 RXD1=LAN8870_RXD1 RXD2=LAN8870_RXD2 RXD3=LAN8870_RXD3 TRX_CON_N=P0_TRX_N TRX_CON_P=P0_TRX_P TX_CLK=LAN8870_TX_CLK TX_CTL=LAN8870_TX_CTL TXD0=LAN8870_TXD0 TXD1=LAN8870_TXD1 TXD2=LAN8870_TXD2 TXD3=LAN8870_TXD3
PHY_5: designators end in _PHY_5; ports CLK_IN=3V3_LAN8870_5_CLK IRQ_N=3V3_LAN8870_5_nIRQ MDC=3V3_MDC MDIO=3V3_MDIO RESET_N=3V3_LAN8870_5_nRST RX_CLK=LAN8870_RX_CLK RX_CTL=LAN8870_RXCTL RXD0=LAN8870_RXD0 RXD1=LAN8870_RXD1 RXD2=LAN8870_RXD2 RXD3=LAN8870_RXD3 TRX_CON_N=P5_TRX_N TRX_CON_P=P5_TRX_P TX_CLK=LAN8870_TX_CLK TX_CTL=LAN8870_TX_CTL TXD0=LAN8870_TXD0 TXD1=LAN8870_TXD1 TXD2=LAN8870_TXD2 TXD3=LAN8870_TXD3
PHY_1: designators end in _PHY_1; ports CLK_IN=3V3_LAN8870_1_CLK IRQ_N=3V3_LAN8870_1_nIRQ MDC=3V3_MDC MDIO=3V3_MDIO RESET_N=3V3_LAN8870_1_nRST RX_CLK=LAN8870_RX_CLK RX_CTL=LAN8870_RXCTL RXD0=LAN8870_RXD0 RXD1=LAN8870_RXD1 RXD2=LAN8870_RXD2 RXD3=LAN8870_RXD3 TRX_CON_N=P1_TRX_N TRX_CON_P=P1_TRX_P TX_CLK=LAN8870_TX_CLK TX_CTL=LAN8870_TX_CTL TXD0=LAN8870_TXD0 TXD1=LAN8870_TXD1 TXD2=LAN8870_TXD2 TXD3=LAN8870_TXD3
PHY_2: designators end in _PHY_2; ports CLK_IN=3V3_LAN8870_2_CLK IRQ_N=3V3_LAN8870_2_nIRQ MDC=3V3_MDC MDIO=3V3_MDIO RESET_N=3V3_LAN8870_2_nRST RX_CLK=LAN8870_RX_CLK RX_CTL=LAN8870_RXCTL RXD0=LAN8870_RXD0 RXD1=LAN8870_RXD1 RXD2=LAN8870_RXD2 RXD3=LAN8870_RXD3 TRX_CON_N=P2_TRX_N TRX_CON_P=P2_TRX_P TX_CLK=LAN8870_TX_CLK TX_CTL=LAN8870_TX_CTL TXD0=LAN8870_TXD0 TXD1=LAN8870_TXD1 TXD2=LAN8870_TXD2 TXD3=LAN8870_TXD3
PHY_3: designators end in _PHY_3; ports CLK_IN=3V3_LAN8870_3_CLK IRQ_N=3V3_LAN8870_3_nIRQ MDC=3V3_MDC MDIO=3V3_MDIO RESET_N=3V3_LAN8870_3_nRST RX_CLK=LAN8870_RX_CLK RX_CTL=LAN8870_RXCTL RXD0=LAN8870_RXD0 RXD1=LAN8870_RXD1 RXD2=LAN8870_RXD2 RXD3=LAN8870_RXD3 TRX_CON_N=P3_TRX_N TRX_CON_P=P3_TRX_P TX_CLK=LAN8870_TX_CLK TX_CTL=LAN8870_TX_CTL TXD0=LAN8870_TXD0 TXD1=LAN8870_TXD1 TXD2=LAN8870_TXD2 TXD3=LAN8870_TXD3
PHY_4: designators end in _PHY_4; ports CLK_IN=3V3_LAN8870_4_CLK IRQ_N=3V3_LAN8870_4_nIRQ MDC=3V3_MDC MDIO=3V3_MDIO RESET_N=3V3_LAN8870_4_nRST RX_CLK=LAN8870_RX_CLK RX_CTL=LAN8870_RXCTL RXD0=LAN8870_RXD0 RXD1=LAN8870_RXD1 RXD2=LAN8870_RXD2 RXD3=LAN8870_RXD3 TRX_CON_N=P4_TRX_N TRX_CON_P=P4_TRX_P TX_CLK=LAN8870_TX_CLK TX_CTL=LAN8870_TX_CTL TXD0=LAN8870_TXD0 TXD1=LAN8870_TXD1 TXD2=LAN8870_TXD2 TXD3=LAN8870_TXD3

### Layout directives
differential pair; differential pair class 100DIFF: TRX_N_PHY_0, TRX_P_PHY_0, TRX_TERM_N_PHY_0, TRX_TERM_P_PHY_0
net class PWR: 3V3, 8870_1V1, LAN8870_VBAT_PHY_0, LAN8870_VDDA_PHY_0, NetC36_PHY_0_1, NetC42_PHY_0_1
net class 50SINGLE: NetC34_PHY_0_1

### Notes on the sheet
- ONLY RXD[0:3] AND RXD_CTL ARE USED FOR STRAPS. OTHER NET LABELS WERE ADDED TO MAKE LAYOUT EASIER
- https://ww1.microchip.com/downloads/aemDocuments/documents/UNG/ProductDocuments/BoardDesignFiles/EVB-LAN8870-RGMII-Schematic.PDF
- PHYAD0
- PHYAD1
- LAN8870 PHY ADDR = 3
- PHYAD3
- PHYAD4
- LED3 WOULD TURN ON, ON THE CUSTOM LAN8870-MB BOARD AT TIMES AND SEEMED TO INDICATE AN ERROR SO I'VE ADDED IT HERE HOWEVER I ALSO WANT TO KNOW IF IRQ_N GOES LOW. LED3 DIDN'T GO LOW UNTIL THE LDOs OF THE LAN8870-MB BOARD WENT ON LIFE SUPPORT
- (near R41) LAN8870 Straps:
  SPEED_SEL (CLKOUT): 0 - 100BASE-T1, 1 - 1000BASE-T1
  REFCLK_SEL (RXD3): 0 - 25MHz Reference Clock, 1 - 50MHz Reference Clock
  PHYAD[1:0] (RXCTL/RXD2)- PHY Address [1:0]
  AUTO_MODE_EN (RXD1): 0 - Managed, 1 - Autonomous
  AUTO_NEG_EN (RXD0): 0 - Auto-Negotiation Disabled, 1 - Auto-Negotiation Enabled
  MODE_STRP (RXER): 0 - Client, 1 - Host

### Library data of the parts
C31-C58 = CMP-001-00058-1: as C59-C102 on sheet SJA1105Q_PINOUT; Min Operating Temperature: -55°C; Mounting Technology: Surface Mount; Pins: 2; Case/Package: 0402; RoHS Compliant: Yes; Max Operating Temperature: 85°C
D6 = CMP-004-00040-2: Led, Red/Grn, 180Mcd/230Mcd, 624Nm/525Nm Rohs Compliant: Yes; Source: rgled.SchLib; Component Type: Standard; Design Item ID: CMP-004-00034-2; Pins: 4
FB6 FB8 FB10 FB11 = CMP-06046-002069-1: as FB13 on sheet SJA1105Q_PINOUT; Packaging: Tape and Reel; Case/Package: 0603; Height: 0.037inch; Case Code (Metric): 1608; Length: 0.063inch; Package Quantity: 4000; Max Operating Temperature: 125°C; Case Code (Imperial): 0603; RoHS Compliant: Yes; Width: 0.032inch; Mount: Surface Mount; Min Operating Temperature: -55°C; Ratings: AEC-Q200; Max Current Rating: 1.7A
L1 = CMP-08256-000023-1: CMC 80UH 70MA 2LN 3.8KOHM SMD
R23 R24 R28-R33 R35 R36 R38 R41-R44 = CMP-009-00002-14: Resistor; Value: 100k
R25-R27 R34 R37 R39 R40 R99 = CMP-009-00002-14: Resistor
  R25-R27: Value: 100k
  R34 R37 R39 R40 R99: Value: DNP
U2 = CMP-015-00023-5: 100/1000BASE-T1 Rgmii/sgmii Phy; Case/Package: VQFN; Pins: 48

## Sheet 74FCT3807S_PINOUT.SchDoc
size A; SheetNumber: 6; SheetTotal: 12
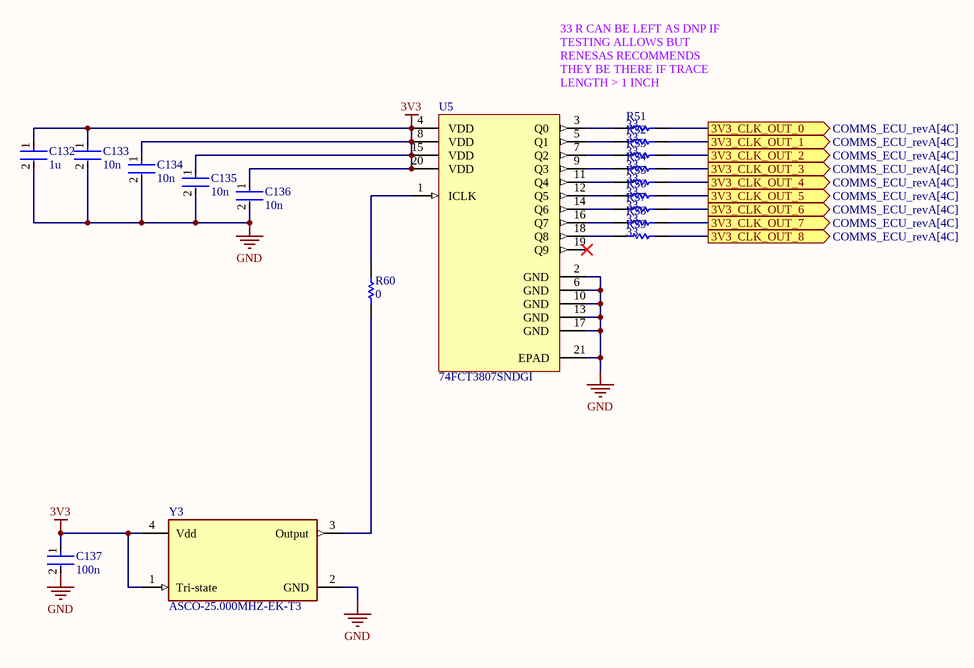
[diagram p10: 74FCT3807S_PINOUT.SchDoc]

### Parts
C132  1u  [FP-0402-L_1_0_0_05-W_0_5-IPC_A]
C133  10n  [FP-0402-L_1_0_0_05-W_0_5-IPC_A]
C134  10n  [FP-0402-L_1_0_0_05-W_0_5-IPC_A]
C135  10n  [FP-0402-L_1_0_0_05-W_0_5-IPC_A]
C136  10n  [FP-0402-L_1_0_0_05-W_0_5-IPC_A]
C137  100n  [FP-0402-L_1_0_0_05-W_0_5-IPC_A]
R51  33  [RESC1005X40X25ML05T05]
R52  33  [RESC1005X40X25ML05T05]
R53  33  [RESC1005X40X25ML05T05]
R54  33  [RESC1005X40X25ML05T05]
R55  33  [RESC1005X40X25ML05T05]
R56  33  [RESC1005X40X25ML05T05]
R57  33  [RESC1005X40X25ML05T05]
R58  33  [RESC1005X40X25ML05T05]
R59  33  [RESC1005X40X25ML05T05]
R60  0  [RESC1005X40X25ML05T05]
U5  74FCT3807SNDGI  [NDG20S2_MFG]
Y3  ASCO-25.000MHZ-EK-T3  [FP-ASCO-MFG]

### Ports
3V3_CLK_OUT_0 (out, see COMMS_ECU_revA[4C]), 3V3_CLK_OUT_1 (out, see COMMS_ECU_revA[4C]), 3V3_CLK_OUT_2 (out, see COMMS_ECU_revA[4C]), 3V3_CLK_OUT_3 (out, see COMMS_ECU_revA[4C]), 3V3_CLK_OUT_4 (out, see COMMS_ECU_revA[4C]), 3V3_CLK_OUT_5 (out, see COMMS_ECU_revA[4C]), 3V3_CLK_OUT_6 (out, see COMMS_ECU_revA[4C]), 3V3_CLK_OUT_7 (out, see COMMS_ECU_revA[4C]), 3V3_CLK_OUT_8 (out, see COMMS_ECU_revA[4C])

### Nets
3V3: C132.1 C133.1 C134.1 C135.1 C136.1 C137.1 U5.4(VDD) U5.8(VDD) U5.15(VDD) U5.20(VDD) Y3.1(Tri-state) Y3.4(Vdd)
GND: C132.2 C133.2 C134.2 C135.2 C136.2 C137.2 U5.2(GND) U5.6(GND) U5.10(GND) U5.13(GND) U5.17(GND) U5.21(EPAD) Y3.2(GND)
3V3_LAN8830_CLK: R57.2 ; port 3V3_CLK_OUT_6
3V3_LAN8870_0_CLK: R51.2 ; port 3V3_CLK_OUT_0
3V3_LAN8870_1_CLK: R52.2 ; port 3V3_CLK_OUT_1
3V3_LAN8870_2_CLK: R53.2 ; port 3V3_CLK_OUT_2
3V3_LAN8870_3_CLK: R54.2 ; port 3V3_CLK_OUT_3
3V3_LAN8870_4_CLK: R55.2 ; port 3V3_CLK_OUT_4
3V3_LAN8870_5_CLK: R56.2 ; port 3V3_CLK_OUT_5
3V3_SJA1105_0_CLK: R58.2 ; port 3V3_CLK_OUT_7
3V3_SJA1105_1_CLK: R59.2 ; port 3V3_CLK_OUT_8
NetR51_1: R51.1 U5.3(Q0)
NetR52_1: R52.1 U5.5(Q1)
NetR53_1: R53.1 U5.7(Q2)
NetR54_1: R54.1 U5.9(Q3)
NetR55_1: R55.1 U5.11(Q4)
NetR56_1: R56.1 U5.12(Q5)
NetR57_1: R57.1 U5.14(Q6)
NetR58_1: R58.1 U5.16(Q7)
NetR59_1: R59.1 U5.18(Q8)
NetR60_1: R60.1 Y3.3(Output)
NetR60_2: R60.2 U5.1(ICLK)

Not connected (* = marked no-connect by the designer): U5 19(Q9)*

### Notes on the sheet
- 33 R CAN BE LEFT AS DNP IF TESTING ALLOWS BUT RENESAS RECOMMENDS THEY BE THERE IF TRACE LENGTH > 1 INCH

### Library data of the parts
C132-C137 = CMP-001-00058-1: as C59-C102 on sheet SJA1105Q_PINOUT; Min Operating Temperature: -55°C; Mounting Technology: Surface Mount; Pins: 2; Case/Package: 0402; RoHS Compliant: Yes; Max Operating Temperature: 85°C
R51-R60 = CMP-009-00118-2: READ THE NAME; Pins: 2; Component Type: Standard; Design Item ID: CMP-009-00206-2; Source: 0402jump.SchLib
  R51-R59: Value: 33
  R60: Value: 0
U5 = CMP-00572-106914266-1: Clock Fanout Buffer (Distribution) IC 110 200 MHz 20-VFQFN Exposed Pad; Manufacturer Lifecycle Status: ACTIVE; Min Supply Voltage: 1.71V; Max Supply Voltage: 3.465V; Pitch: 400µm; Max Output Frequency: 200MHz; HelpURL: https://octopart.com/cad-content/api/get-model-datasheet/15189/106914266; Number of Pins: 20; ComponentLink1Description: Manufacturer's Website; Min Operating Temperature: -40°C; Max Operating Temperature: 105°C; MSL: 1; ComponentLink3Description: Manufacturer's Package Drawing; Lifecycle Status: Production; Harmonized Tariff Schedule (HTS) Code: 8540000000; ComponentLink2Description: Datasheet URL; RoHS: Compliant; ComponentLink3URL: https://www.renesas.com/en/document/psc/20-vfqfpn-package-outline-drawing-30-x-30-x-090-mm-040mm-pitch-165-x-165-mm-epad-wettable-flank; Mount: Surface Mount; Width: 3mm; Contact Plating: Tin; Package Quantity: 0; Height: 1mm; ComponentLink1URL: http://www.renesas.com; ComponentLink2URL: https://octopart.com/cad-content/api/get-model-datasheet/15189/106914266; Export Control Classification Number (ECCN) Code: NLR; Lead Free: Lead Free; Thickness: 1mm; Part Family: 74FCT3807S; Length: 3mm
Y3 = CMP-27762-011440-1: XTAL OSC XO 25.0000MHZ CMOS SMD; Min Supply Voltage: 2.97V; Frequency: 25MHz; Max Supply Voltage: 3.63V; Max Supply Current: 6mA; Load Capacitance: 15pF; Frequency Stability: 30ppm; Operating Supply Voltage: 3.3V; Termination: SMD/SMT; Length: 0.063inch; Min Operating Temperature: -20°C; Height: 0.028inch; Number of Pins: 4; Case/Package: SMD/SMT; Packaging: Tape and Reel; Max Operating Temperature: 70°C; Package Quantity: 3000; Mount: Surface Mount; Width: 0.047inch

## Sheet STM32H730_PINOUT.SchDoc
size C; SheetNumber: 5; SheetTotal: 12
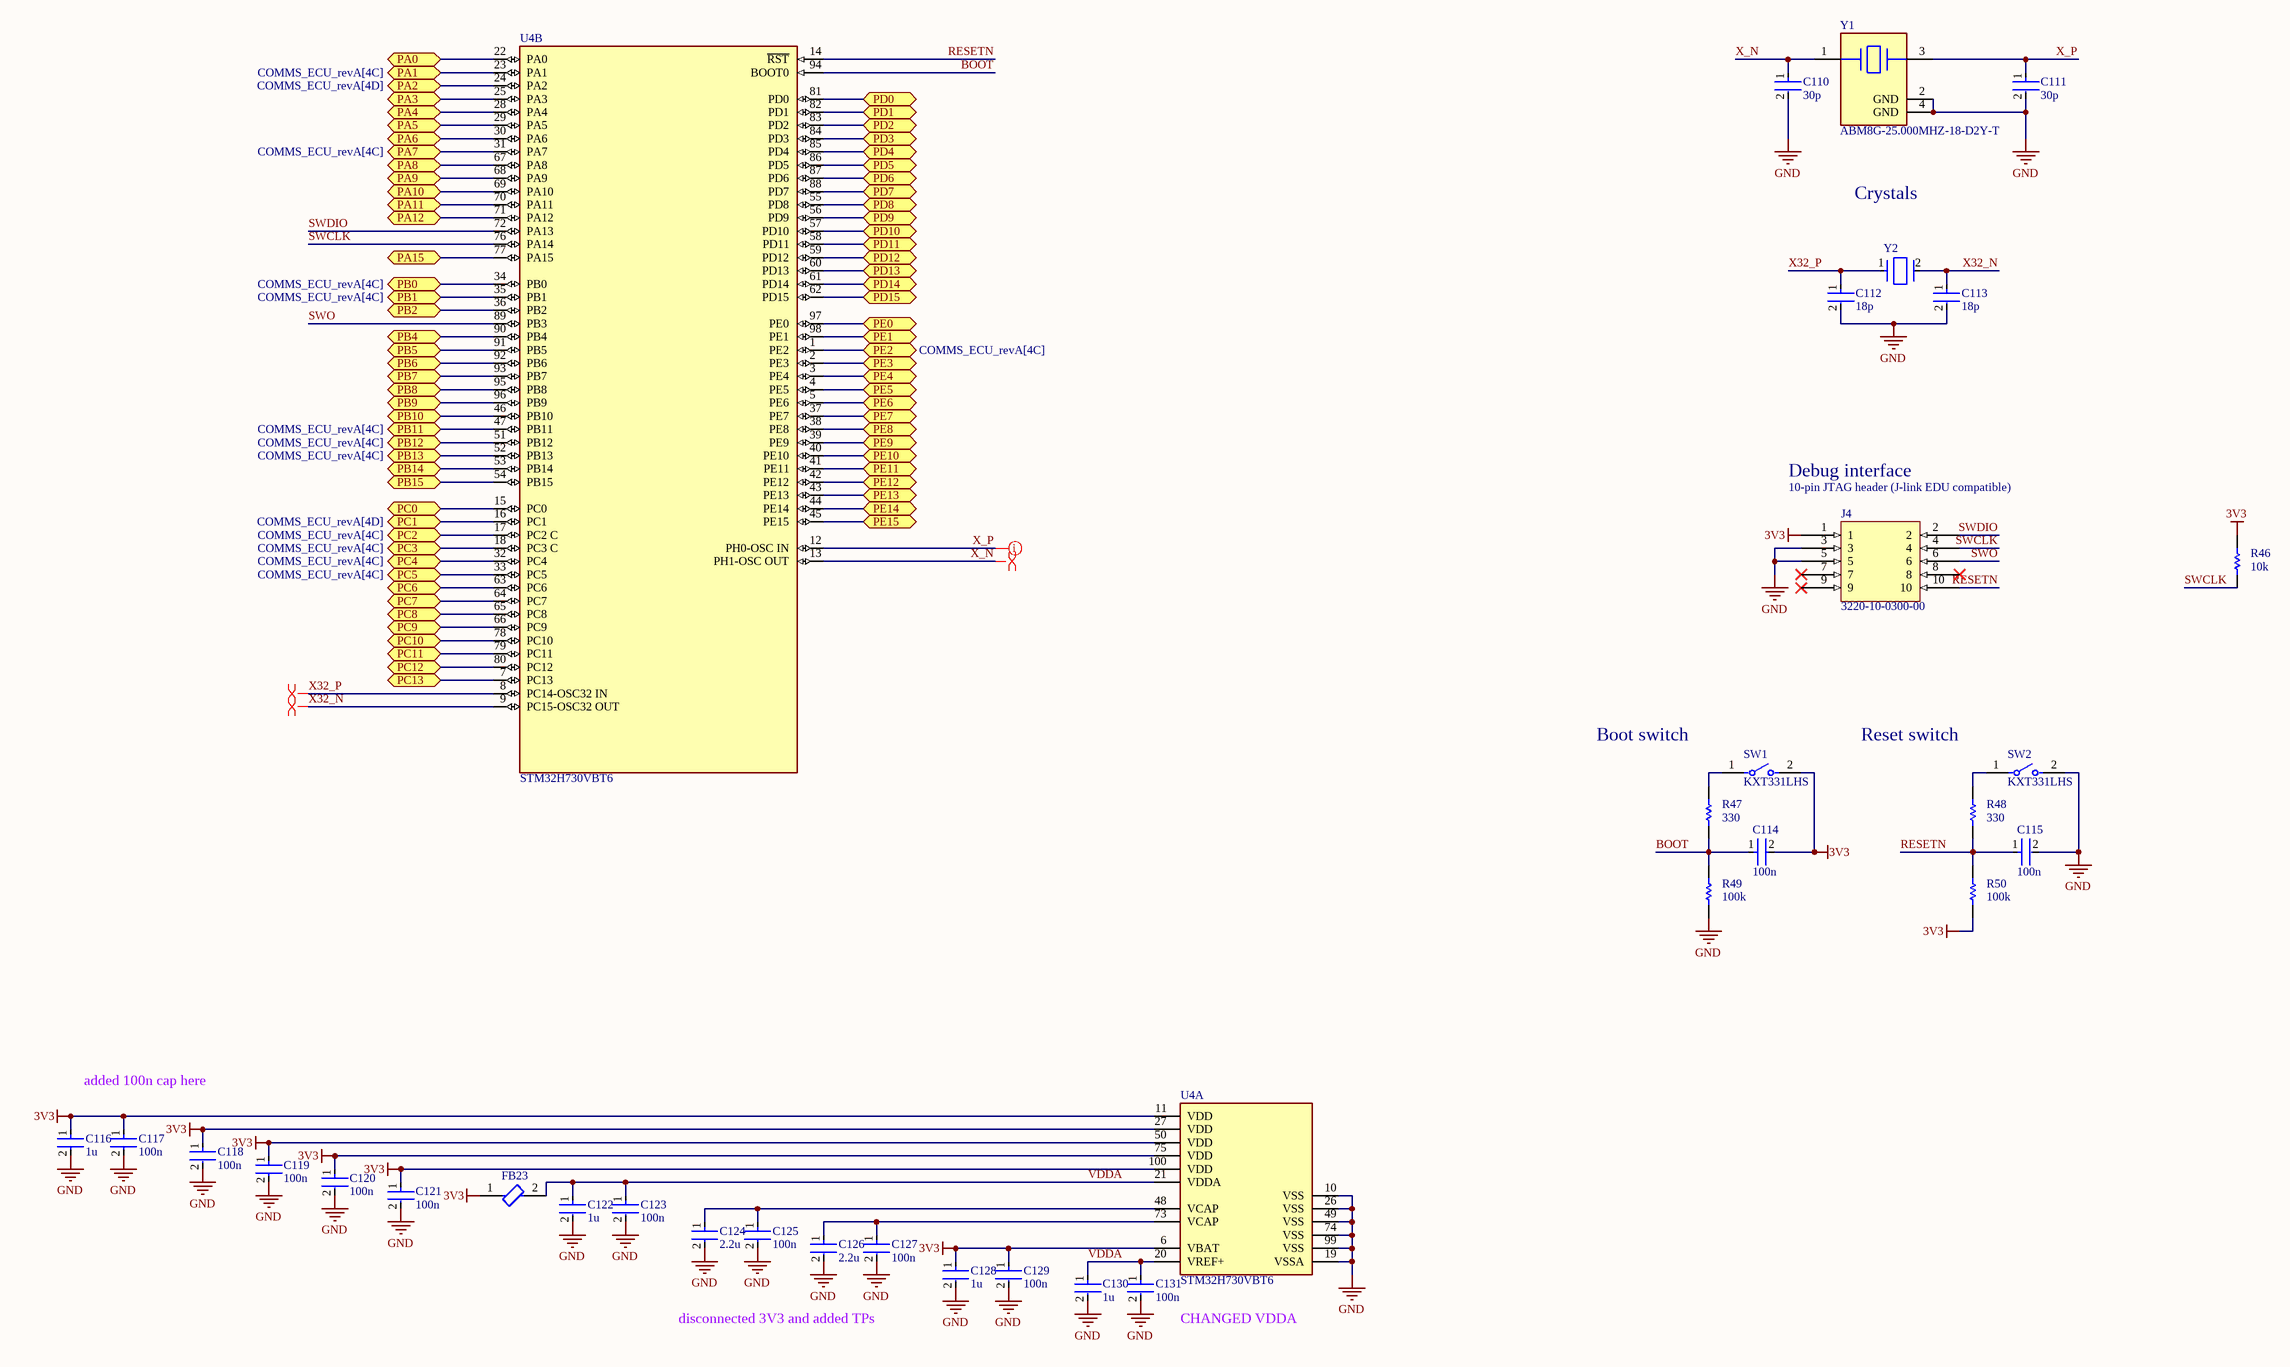
[diagram p11: STM32H730_PINOUT.SchDoc]

### Parts
C110  30p  [FP-0402-L_1_0_0_05-W_0_5-IPC_A]
C111  30p  [FP-0402-L_1_0_0_05-W_0_5-IPC_A]
C112  18p  [FP-0402-L_1_0_0_05-W_0_5-IPC_A]
C113  18p  [FP-0402-L_1_0_0_05-W_0_5-IPC_A]
C114  100n  [FP-0402-L_1_0_0_05-W_0_5-IPC_A]
C115  100n  [FP-0402-L_1_0_0_05-W_0_5-IPC_A]
C116  1u  [FP-0402-L_1_0_0_05-W_0_5-IPC_A]
C117  100n  [FP-0402-L_1_0_0_05-W_0_5-IPC_A]
C118  100n  [FP-0402-L_1_0_0_05-W_0_5-IPC_A]
C119  100n  [FP-0402-L_1_0_0_05-W_0_5-IPC_A]
C120  100n  [FP-0402-L_1_0_0_05-W_0_5-IPC_A]
C121  100n  [FP-0402-L_1_0_0_05-W_0_5-IPC_A]
C122  1u  [FP-0402-L_1_0_0_05-W_0_5-IPC_A]
C123  100n  [FP-0402-L_1_0_0_05-W_0_5-IPC_A]
C124  2.2u  [FP-0402-L_1_0_0_05-W_0_5-IPC_A]
C125  100n  [FP-0402-L_1_0_0_05-W_0_5-IPC_A]
C126  2.2u  [FP-0402-L_1_0_0_05-W_0_5-IPC_A]
C127  100n  [FP-0402-L_1_0_0_05-W_0_5-IPC_A]
C128  1u  [FP-0402-L_1_0_0_05-W_0_5-IPC_A]
C129  100n  [FP-0402-L_1_0_0_05-W_0_5-IPC_A]
C130  1u  [FP-0402-L_1_0_0_05-W_0_5-IPC_A]
C131  100n  [FP-0402-L_1_0_0_05-W_0_5-IPC_A]
FB23  BLM15PX601SN1D  [FP-BLM15-0_05-IPC_A]  (value not drawn)
J4  3220-10-0300-00  [3220-10-0300-00-Footprint-1]
R46  10k  [R0603B]
R47  330  [R0603B]
R48  330  [R0603B]
R49  100k  [R0603B]
R50  100k  [R0603B]
SW1  KXT331LHS  [FP-KXT331LHS-MFG]
SW2  KXT331LHS  [FP-KXT331LHS-MFG]
U4  STM32H730VBT6  [FP-LQFP100-1L-IPC_C]  (parts A,B of 2)
Y1  ABM8G-25.000MHZ-18-D2Y-T  [FP-ABM8G-MFG]
Y2  ECS-.327-12.5-1210-TR  [FP-ECX-1210-MFG]  (value not drawn)

### Ports
PA0 (bidir), PA1 (bidir, see COMMS_ECU_revA[4C]), PA2 (bidir, see COMMS_ECU_revA[4D]), PA3 (bidir), PA4 (bidir), PA5 (bidir), PA6 (bidir), PA7 (bidir, see COMMS_ECU_revA[4C]), PA8 (bidir), PA9 (bidir), PA10 (bidir), PA11 (bidir), PA12 (bidir), PA15 (bidir), PB0 (bidir, see COMMS_ECU_revA[4C]), PB1 (bidir, see COMMS_ECU_revA[4C]), PB2 (bidir), PB4 (bidir), PB5 (bidir), PB6 (bidir), PB7 (bidir), PB8 (bidir), PB9 (bidir), PB10 (bidir), PB11 (bidir, see COMMS_ECU_revA[4C]), PB12 (bidir, see COMMS_ECU_revA[4C]), PB13 (bidir, see COMMS_ECU_revA[4C]), PB14 (bidir), PB15 (bidir), PC0 (bidir), PC1 (bidir, see COMMS_ECU_revA[4D]), PC2 (bidir, see COMMS_ECU_revA[4C]), PC3 (bidir, see COMMS_ECU_revA[4C]), PC4 (bidir, see COMMS_ECU_revA[4C]), PC5 (bidir, see COMMS_ECU_revA[4C]), PC6 (bidir), PC7 (bidir), PC8 (bidir), PC9 (bidir), PC10 (bidir), PC11 (bidir), PC12 (bidir), PC13 (bidir), PD0 (bidir), PD1 (bidir), PD2 (bidir), PD3 (bidir), PD4 (bidir), PD5 (bidir), PD6 (bidir), PD7 (bidir), PD8 (bidir), PD9 (bidir), PD10 (bidir), PD11 (bidir), PD12 (bidir), PD13 (bidir), PD14 (bidir), PD15 (bidir), PE0 (bidir), PE1 (bidir), PE2 (bidir, see COMMS_ECU_revA[4C]), PE3 (bidir), PE4 (bidir), PE5 (bidir), PE6 (bidir), PE7 (bidir), PE8 (bidir), PE9 (bidir), PE10 (bidir), PE11 (bidir), PE12 (bidir), PE13 (bidir), PE14 (bidir), PE15 (bidir)

### Nets
3V3: C114.2 C116.1 C117.1 C118.1 C119.1 C120.1 C121.1 C128.1 C129.1 FB23.1 J4.1 R46.2 R50.1 SW1.2 U4.6(VBAT) U4.11(VDD) U4.27(VDD) U4.50(VDD) U4.75(VDD) U4.100(VDD)
GND: C110.2 C111.2 C112.2 C113.2 C115.2 C116.2 C117.2 C118.2 C119.2 C120.2 C121.2 C122.2 C123.2 C124.2 C125.2 C126.2 C127.2 C128.2 C129.2 C130.2 C131.2 J4.3 J4.5 R49.1 SW2.2 U4.10(VSS) U4.19(VSSA) U4.26(VSS) U4.49(VSS) U4.74(VSS) U4.99(VSS) Y1.2(GND) Y1.4(GND)
3V3_MDC: U4.16(PC1) ; port PC1
3V3_MDIO: U4.24(PA2) ; port PA2
BOOT: C114.1 R47.1 R49.2 U4.94(BOOT0)
RESETN: C115.1 J4.10 R48.1 R50.2 U4.14(~{RST})
SWCLK: J4.4 R46.1 U4.76(PA14)
SWDIO: J4.2 U4.72(PA13)
SWO: J4.6 U4.89(PB3)
VDDA: C122.1 C123.1 C130.1 C131.1 FB23.2 U4.20(VREF+) U4.21(VDDA)
X32_N: C113.1 U4.9(PC15-OSC32_OUT) Y2.2(Out/In)
X32_P: C112.1 U4.8(PC14-OSC32_IN) Y2.1(In/Out)
X_N: C110.1 U4.13(PH1-OSC_OUT) Y1.1
X_P: C111.1 U4.12(PH0-OSC_IN) Y1.3
NetC124_1: C124.1 C125.1 U4.48(VCAP)
NetC126_1: C126.1 C127.1 U4.73(VCAP)
NetR47_2: R47.2 SW1.1
NetR48_2: R48.2 SW2.1
NetU3_SJA1150Q_PINOUT_1_N7: U4.52(PB13) ; port PB13
NetU3_SJA1150Q_PINOUT_1_N8: U4.1(PE2) ; port PE2
NetU3_SJA1150Q_PINOUT_1_N9: U4.18(PC3_C) ; port PC3
NetU3_SJA1150Q_PINOUT_1_N10: U4.32(PC4) ; port PC4
NetU3_SJA1150Q_PINOUT_1_N11: U4.34(PB0) ; port PB0
NetU3_SJA1150Q_PINOUT_1_N12: U4.31(PA7) ; port PA7
NetU3_SJA1150Q_PINOUT_1_P7: U4.51(PB12) ; port PB12
NetU3_SJA1150Q_PINOUT_1_P8: U4.17(PC2_C) ; port PC2
NetU3_SJA1150Q_PINOUT_1_P9: U4.47(PB11) ; port PB11
NetU3_SJA1150Q_PINOUT_1_P10: U4.23(PA1) ; port PA1
NetU3_SJA1150Q_PINOUT_1_P11: U4.33(PC5) ; port PC5
NetU3_SJA1150Q_PINOUT_1_P12: U4.35(PB1) ; port PB1
NetU4_2: U4.2(PE3) ; port PE3
NetU4_3: U4.3(PE4) ; port PE4
NetU4_4: U4.4(PE5) ; port PE5
NetU4_5: U4.5(PE6) ; port PE6
NetU4_7: U4.7(PC13) ; port PC13
NetU4_15: U4.15(PC0) ; port PC0
NetU4_22: U4.22(PA0) ; port PA0
NetU4_25: U4.25(PA3) ; port PA3
NetU4_28: U4.28(PA4) ; port PA4
NetU4_29: U4.29(PA5) ; port PA5
NetU4_30: U4.30(PA6) ; port PA6
NetU4_36: U4.36(PB2) ; port PB2
NetU4_37: U4.37(PE7) ; port PE7
NetU4_38: U4.38(PE8) ; port PE8
NetU4_39: U4.39(PE9) ; port PE9
NetU4_40: U4.40(PE10) ; port PE10
NetU4_41: U4.41(PE11) ; port PE11
NetU4_42: U4.42(PE12) ; port PE12
NetU4_43: U4.43(PE13) ; port PE13
NetU4_44: U4.44(PE14) ; port PE14
NetU4_45: U4.45(PE15) ; port PE15
NetU4_46: U4.46(PB10) ; port PB10
NetU4_53: U4.53(PB14) ; port PB14
NetU4_54: U4.54(PB15) ; port PB15
NetU4_55: U4.55(PD8) ; port PD8
NetU4_56: U4.56(PD9) ; port PD9
NetU4_57: U4.57(PD10) ; port PD10
NetU4_58: U4.58(PD11) ; port PD11
NetU4_59: U4.59(PD12) ; port PD12
NetU4_60: U4.60(PD13) ; port PD13
NetU4_61: U4.61(PD14) ; port PD14
NetU4_62: U4.62(PD15) ; port PD15
NetU4_63: U4.63(PC6) ; port PC6
NetU4_64: U4.64(PC7) ; port PC7
NetU4_65: U4.65(PC8) ; port PC8
NetU4_66: U4.66(PC9) ; port PC9
NetU4_67: U4.67(PA8) ; port PA8
NetU4_68: U4.68(PA9) ; port PA9
NetU4_69: U4.69(PA10) ; port PA10
NetU4_70: U4.70(PA11) ; port PA11
NetU4_71: U4.71(PA12) ; port PA12
NetU4_77: U4.77(PA15) ; port PA15
NetU4_78: U4.78(PC10) ; port PC10
NetU4_79: U4.79(PC11) ; port PC11
NetU4_80: U4.80(PC12) ; port PC12
NetU4_81: U4.81(PD0) ; port PD0
NetU4_82: U4.82(PD1) ; port PD1
NetU4_83: U4.83(PD2) ; port PD2
NetU4_84: U4.84(PD3) ; port PD3
NetU4_85: U4.85(PD4) ; port PD4
NetU4_86: U4.86(PD5) ; port PD5
NetU4_87: U4.87(PD6) ; port PD6
NetU4_88: U4.88(PD7) ; port PD7
NetU4_90: U4.90(PB4) ; port PB4
NetU4_91: U4.91(PB5) ; port PB5
NetU4_92: U4.92(PB6) ; port PB6
NetU4_93: U4.93(PB7) ; port PB7
NetU4_95: U4.95(PB8) ; port PB8
NetU4_96: U4.96(PB9) ; port PB9
NetU4_97: U4.97(PE0) ; port PE0
NetU4_98: U4.98(PE1) ; port PE1

Not connected (* = marked no-connect by the designer): J4 7* 8* 9*

### Layout directives
differential pair: X32_N, X32_P, X_N, X_P

### Notes on the sheet
- Crystals
- Debug interface
- (near J4) 10-pin JTAG header (J-link EDU compatible)
- Boot switch
- Reset switch
- added 100n cap here
- disconnected 3V3 and added TPs
- CHANGED VDDA

### Library data of the parts
C110-C131 = CMP-001-00058-1: as C59-C102 on sheet SJA1105Q_PINOUT; Min Operating Temperature: -55°C; Mounting Technology: Surface Mount; Pins: 2; Case/Package: 0402; RoHS Compliant: Yes; Max Operating Temperature: 85°C
FB23 = CMP-0686-00252-4: Chip Ferrite Bead, 0402, 600Ω @ 100MHz, 0.23Ω, 25%, 900mA; Number of Circuits: 1; Impedance: 600R; DC Resistance (DCR): 230mR; Material: Steel; Length: 1mm; Package Quantity: 10000; Height: 0.5mm; Width: 0.5mm; Max DC Current: 900mA; Number of Lines: 1; Termination: SMD/SMT; Packaging: Tape and Reel; Lead Free: Lead Free; Min Operating Temperature: -55°C; Max Operating Temperature: 125°C; Max Current Rating: 900mA; Case Code (Imperial): 0402; Number of Pins: 2; Current Rating: 900mA; Test Frequency: 100MHz; Case/Package: 0402; Tolerance: 25%; Case Code (Metric): 1005
J4 = CMP-001-0013-3: CONN HEADER SMD 10POS 1.27MM
R46-R48 = CMP-009-00002-14: Resistor
  R46: Value: 10k
  R47 R48: Value: 330
R49 R50 = CMP-009-00002-14: Resistor; Value: 10k
SW1 SW2 = CMP-10040-000029-1: SWITCH TACTILE SPST-NO 0.02A 15V; Operating Force: 240gf; Switch Travel: 0.13mm; Illumination Type: Non-Illuminated; Throw Configuration: SPST; Number of Ports: 1; Current Rating: 5A; Mechanical Life: 500000Cycles; Switch Function: Off-Mom; Connector Type: USB; Actuator Type: Standard; Gender: Receptacle; Number of Contacts: 24; Contact Plating: Gold; Insulation Color: Black; Min Operating Temperature: -40°C; Packaging: Tape and Reel; Flammability Rating: UL94 V-0; Max Operating Temperature: 85°C; Termination: Solder; Mount: Surface Mount
U4 = CMP-12105-000107-1: IC MCU 32BIT 128KB FLASH 100LQFP
Y1 = CMP-2000-05733-3: Crystal 25MHz ±20ppm (Tol) ±30ppm (Stability) 18pF FUND 60Ω 4-Pin SMD T/R; Series Resistance: 60R; Length: 3.2mm; Depth: 2.5mm; Packaging: Tape and Reel; Min Operating Temperature: -40°C; Operating Frequency: 25 MHz; Lead Free: Lead Free; Number of Pins: 4; Frequency Tolerance: 20ppm; Radiation Hardening: No; Max Operating Temperature: 85°C; Termination: SMD/SMT; Frequency Stability: 30ppm; Frequency: 25MHz; Series: ABM8G; Mount: Surface Mount; Package Quantity: 1000; Height: 0.039inch; Width: 0.098inch; Case/Package: CSMD; ESR (Equivalent Series Resistance): 60R; Load Capacitance: 18pF; Tolerance: 20ppm
Y2 = CMP-40224-000006-1: CRYSTAL 32.7680KHZ 12.5PF SMD; Manufacturer: ECS International; Frequency: 32.768kHz; Esr: 90kΩ; Tolerance: 20ppm; Device Class L1: Passive Components; Load Capacitance: 12.5pF; Temperature: -40°C to +85°C; ComponentLink2URL: https://ecsxtal.com/store/pdf/ECX-1210.pdf; Series: ECX-1210; Octopart: https://octopart.com/ecs-.327-12.5-1210-tr-ecs+international-81221340; ComponentLink2Description: Datasheet; Temperature Range Low: -40°C; Digikey Description: CRYSTAL 32.7680KHZ 12.5PF SMD; Lead Free: Yes; RoHS: TRUE; Device Class L3: Crystals; Automotive: No; Category: Crys; Height: 0.5mm; Manufacturer Part Number: ECS-.327-12.5-1210-TR; Temperature Range High: +85°C; Device Class L2: Crystals / Oscillators; Package: ECX-1210

## Sheet TCAN1146_PINOUT.SchDoc
size B; SheetNumber: 9; SheetTotal: 12
Used 2 times, as channels TCAN1146_0, TCAN1146_1. Parts and nets are listed once, with the designators drawn on the sheet.
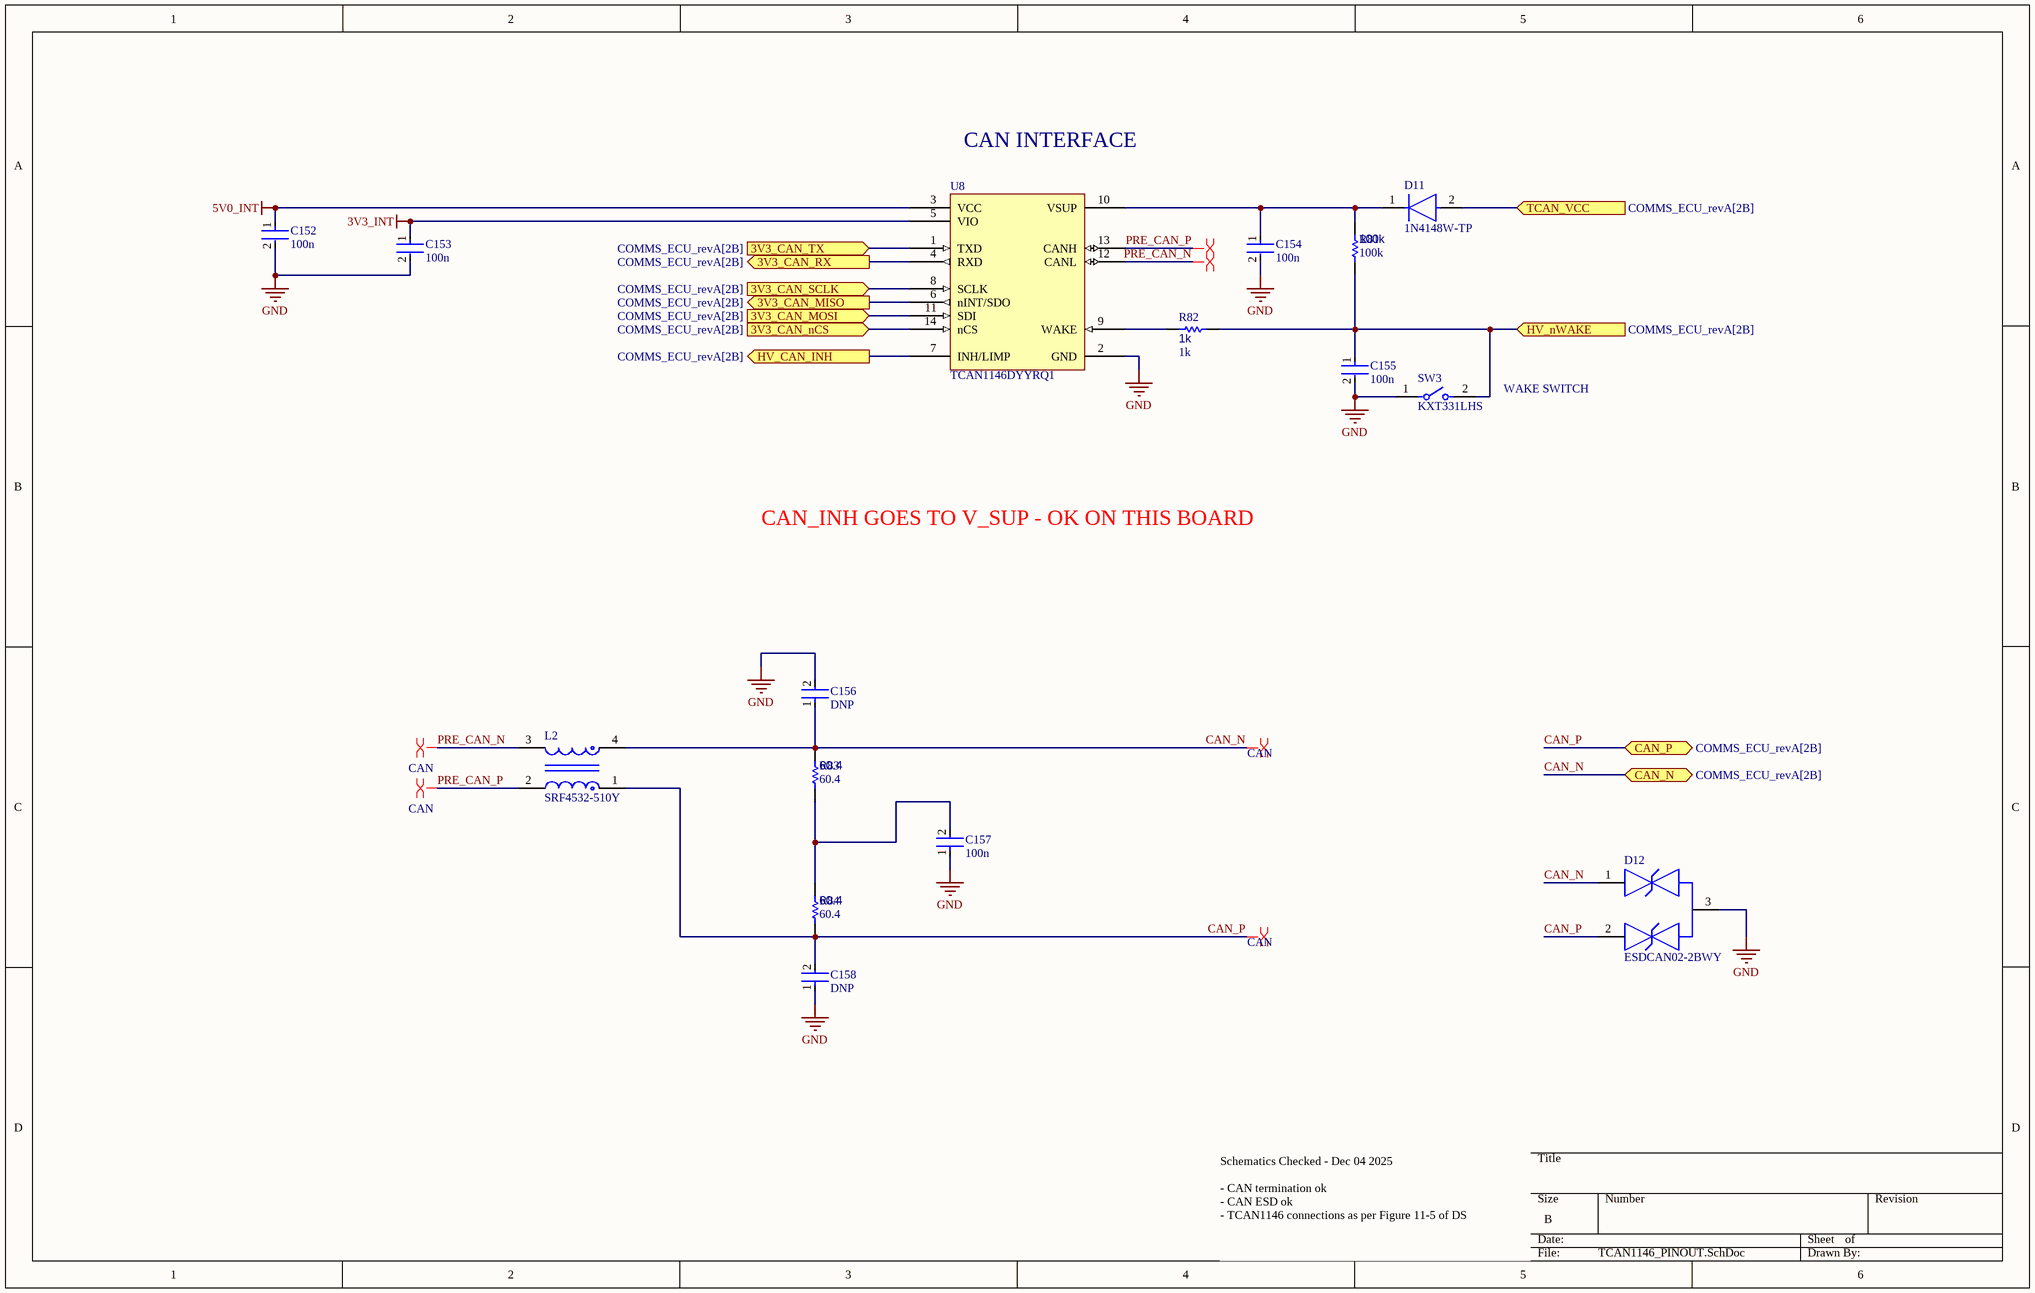
[diagram p12: TCAN1146_PINOUT.SchDoc]

### Parts
C152  100n  [FP-0402-L_1_0_0_05-W_0_5-IPC_A]
C153  100n  [FP-0402-L_1_0_0_05-W_0_5-IPC_A]
C154  100n  [FP-0402-L_1_0_0_05-W_0_5-IPC_A]
C155  100n  [FP-0402-L_1_0_0_05-W_0_5-IPC_A]
C156  DNP  [FP-0402-L_1_0_0_05-W_0_5-IPC_A]
C157  100n  [FP-0402-L_1_0_0_05-W_0_5-IPC_A]
C158  DNP  [FP-0402-L_1_0_0_05-W_0_5-IPC_A]
D11  1N4148W-TP  [FP-SOD-123-IPC_A]
D12  ESDCAN02-2BWY  [FP-SOT323-3L-MFG]
L2  SRF4532-510Y  [FP-SRF4532-MFG]
R81  100k  [R0603B]
R82  1k  [R0603B]
R83  60.4  [R0603B]
R84  60.4  [R0603B]
SW3  KXT331LHS  [FP-KXT331LHS-MFG]
U8  TCAN1146DYYRQ1  [TCAN1146DYYRQ1-Footprint-1]

### Ports
3V3_CAN_MISO (out, see COMMS_ECU_revA[2B]), 3V3_CAN_MOSI (in, see COMMS_ECU_revA[2B]), 3V3_CAN_nCS (in, see COMMS_ECU_revA[2B]), 3V3_CAN_RX (out, see COMMS_ECU_revA[2B]), 3V3_CAN_SCLK (in, see COMMS_ECU_revA[2B]), 3V3_CAN_TX (in, see COMMS_ECU_revA[2B]), CAN_N (bidir, see COMMS_ECU_revA[2B]), CAN_P (bidir, see COMMS_ECU_revA[2B]), HV_CAN_INH (out, see COMMS_ECU_revA[2B]), HV_nWAKE (in, see COMMS_ECU_revA[2B]), TCAN_VCC (in, see COMMS_ECU_revA[2B])

### Nets
3V3_INT: C153.1 U8.5(VIO)
5V0_INT: C152.1 U8.3(VCC)
GND: C152.2 C153.2 C154.2 C155.2 C156.2 C157.1 C158.1 D12.3 SW3.1 U8.2(GND)
3V3_CAN_MISO: U8.6(nINT/SDO) ; port 3V3_CAN_MISO
3V3_CAN_MOSI: U8.11(SDI) ; port 3V3_CAN_MOSI
3V3_CAN_nCS: U8.14(nCS) ; port 3V3_CAN_nCS
3V3_CAN_RX: U8.4(RXD) ; port 3V3_CAN_RX
3V3_CAN_SCLK: U8.8(SCLK) ; port 3V3_CAN_SCLK
3V3_CAN_TX: U8.1(TXD) ; port 3V3_CAN_TX
CAN_N: C156.1 D12.1 L2.4 R83.2 ; port CAN_N
CAN_P: C158.2 D12.2 L2.1 R84.1 ; port CAN_P
HV_CAN_INH: U8.7(INH/LIMP) ; port HV_CAN_INH
HV_nWAKE: C155.1 R81.1 R82.2 SW3.2 ; port HV_nWAKE
PRE_CAN_N: L2.3 U8.12(CANL)
PRE_CAN_P: L2.2 U8.13(CANH)
TCAN_VCC: D11.2(A) ; port TCAN_VCC
NetC154_1: C154.1 D11.1(C) R81.2 U8.10(VSUP)
NetC157_2: C157.2 R83.1 R84.2
NetR82_1: R82.1 U8.9(WAKE)

### Channels
TCAN1146_0: designators end in _TCAN1146_0; ports 3V3_CAN_MISO=3V3_TCAN1146_MISO 3V3_CAN_MOSI=3V3_TCAN1146_MOSI 3V3_CAN_nCS=3V3_TCAN1146_0_nCS 3V3_CAN_RX=3V3_CAN0_RX 3V3_CAN_SCLK=3V3_TCAN1146_SCLK 3V3_CAN_TX=3V3_CAN0_TX CAN_N=CAN0_N CAN_P=CAN0_P HV_CAN_INH=NetD1_2 HV_nWAKE=3V3_TCAN1146_WAKE TCAN_VCC=PRE_VCC
TCAN1146_1: designators end in _TCAN1146_1; ports 3V3_CAN_MISO=3V3_TCAN1146_MISO 3V3_CAN_MOSI=3V3_TCAN1146_MOSI 3V3_CAN_nCS=3V3_TCAN1146_1_nCS 3V3_CAN_RX=3V3_CAN1_RX 3V3_CAN_SCLK=3V3_TCAN1146_SCLK 3V3_CAN_TX=3V3_CAN1_TX CAN_N=CAN1_N CAN_P=CAN1_P HV_CAN_INH=NetD2_2 HV_nWAKE=NetC155_TCAN1146_1_1 TCAN_VCC=PRE_VCC

### Layout directives
differential pair: PRE_CAN_N_TCAN1146_0, PRE_CAN_P_TCAN1146_0
differential pair; differential pair class CAN: CAN0_N, CAN0_P, PRE_CAN_N_TCAN1146_0, PRE_CAN_P_TCAN1146_0

### Notes on the sheet
- CAN INTERFACE
- WAKE SWITCH
- CAN_INH GOES TO V_SUP - OK ON THIS BOARD
- Schematics Checked - Dec 04 2025
  - CAN termination ok
  - CAN ESD ok
  - TCAN1146 connections as per Figure 11-5 of DS

### Library data of the parts
C152-C158 = CMP-001-00058-1: as C59-C102 on sheet SJA1105Q_PINOUT; Min Operating Temperature: -55°C; Mounting Technology: Surface Mount; Pins: 2; Case/Package: 0402; RoHS Compliant: Yes; Max Operating Temperature: 85°C
D11 = CMP-2000-04993-2: DIODE GEN PURP 100V 150MA SOD123; Max Reverse Leakage Current: 5uA; Max Surge Current: 2A; Reverse Recovery Time: 4ns; Polarity: Standard; Capacitance: 4pF; Max Forward Surge Current (Ifsm): 1A; Element Configuration: Single; Power Dissipation: 400mW; Forward Voltage: 1V; Radiation Hardening: No; Lead Free: Lead Free; Max Reverse Voltage (DC): 100V; Current Rating: 150mA; Forward Current: 150mA; Packaging: Tape and Reel; Number of Pins: 2; Package Quantity: 3000; Max Operating Temperature: 150°C; Min Operating Temperature: -65°C; Average Rectified Current: 150mA; Recovery Time: 4ns; Output Current: 150mA; Peak Non-Repetitive Surge Current: 2A; Width: 1.8mm; Voltage Rating (DC): 100V; Height: 1.2mm; Max Repetitive Reverse Voltage (Vrrm): 100V; Mount: Surface Mount; Length: 2.85mm
D12 = CMP-12225-000055-1: TVS DIODE 26.5V 44V SOT323-3; Manufacturer: STMicroelectronics; Value: 3pF; Direction: Bidirectional; Breakdown Voltage: 28.5V; Automotive Grade: Grade 0; Standoff Height: 0mm; Peak Pulse Power: 170W; Peak Pulse Current: 3A; Number Of Channels: 2; Max Junction Temp: +175°C; Mouser Description: TVS Diodes / ESD Suppressors Automotive dual-line Transil, Transient voltage suppressor (TVS) for CAN bus; Height: 1.1mm; Category: Diode; Reverse Standoff Voltage: 26.5V; Device Class L1: Circuit Protection; Temperature: -55°C to +175°C; RoHS: TRUE; ComponentLink2URL: https://www.st.com/resource/en/datasheet/esdcan02-2bwy.pdf; Device Class L3: unset; Device Class L2: TVS Diodes; Temperature Range High: +175°C; Octopart: https://octopart.com/esdcan02-2bwy-stmicroelectronics-58631133; Ipc Land Pattern Name: SOT65P210X95-3; Temperature Range Low: -55°C; Capacitance: 3pF; Digikey Description: TVS DIODE 26.5V 44V SOT323-3; Automotive: Yes; ComponentLink2Description: Datasheet; Clamping Voltage: 44V; Manufacturer Part Number: ESDCAN02-2BWY; Lead Free: Yes; Package: SOT323-3L
L2 = CMP-07251-000006-1: CMC 51UH 200MA 2LN 2KOHM SMD; Element Configuration: Dual; Number of Lines: 2; Core Material: Ferrite; Impedance: 2kR; Test Frequency: 100kHz; Voltage Rating (DC): 50V; Insulation Resistance: 10MR; Material: Steel; Tolerance: 50%; DC Resistance (DCR): 3.5R; RoHS Compliant: Yes; Mount: Surface Mount; REACH SVHC: No SVHC; Termination: SMD/SMT; DC Current: 200mA; Current: 200mA; Lead Free: Lead Free; Contact Plating: Tin; Length: 4.5mm; Max DC Current: 200mA; Width: 0.126inch; Case/Package: 4532; Packaging: Tape and Reel; Package Quantity: 1; Min Operating Temperature: -40°C; Depth: 3.4mm; Series: SRF4532; Max Operating Temperature: 125°C; Current Rating: 200mA; Self Resonant Frequency: 100kHz; Height: 0.118inch; Inductance: 51uH; Resistance: 2kR
R81-R84 = CMP-009-00002-14: Resistor
  R81: Value: 100k
  R82: Value: 1k
  R83 R84: Value: 60.4
SW3 = CMP-10040-000029-1: as SW1 on sheet STM32H730_PINOUT; Contact Plating: Gold; Insulation Color: Black; Min Operating Temperature: -40°C; Packaging: Tape and Reel; Flammability Rating: UL94 V-0; Max Operating Temperature: 85°C; Termination: Solder; Mount: Surface Mount
U8 = CMP-318-000000-2: Automotive CAN FD transceiver with watchdog, bus diagnostics and partial networking via sele 14-SOT-23-THIN -40 to 150; Component Type: Standard; Design Item ID: CMP-015-00012-2; Pin Count: 14; Source: TCAN1146DYYRQ1.SchLib